# EAGLE design PT08Mpld (EAGLE 6.6.0)

## Sheet 1 of 3
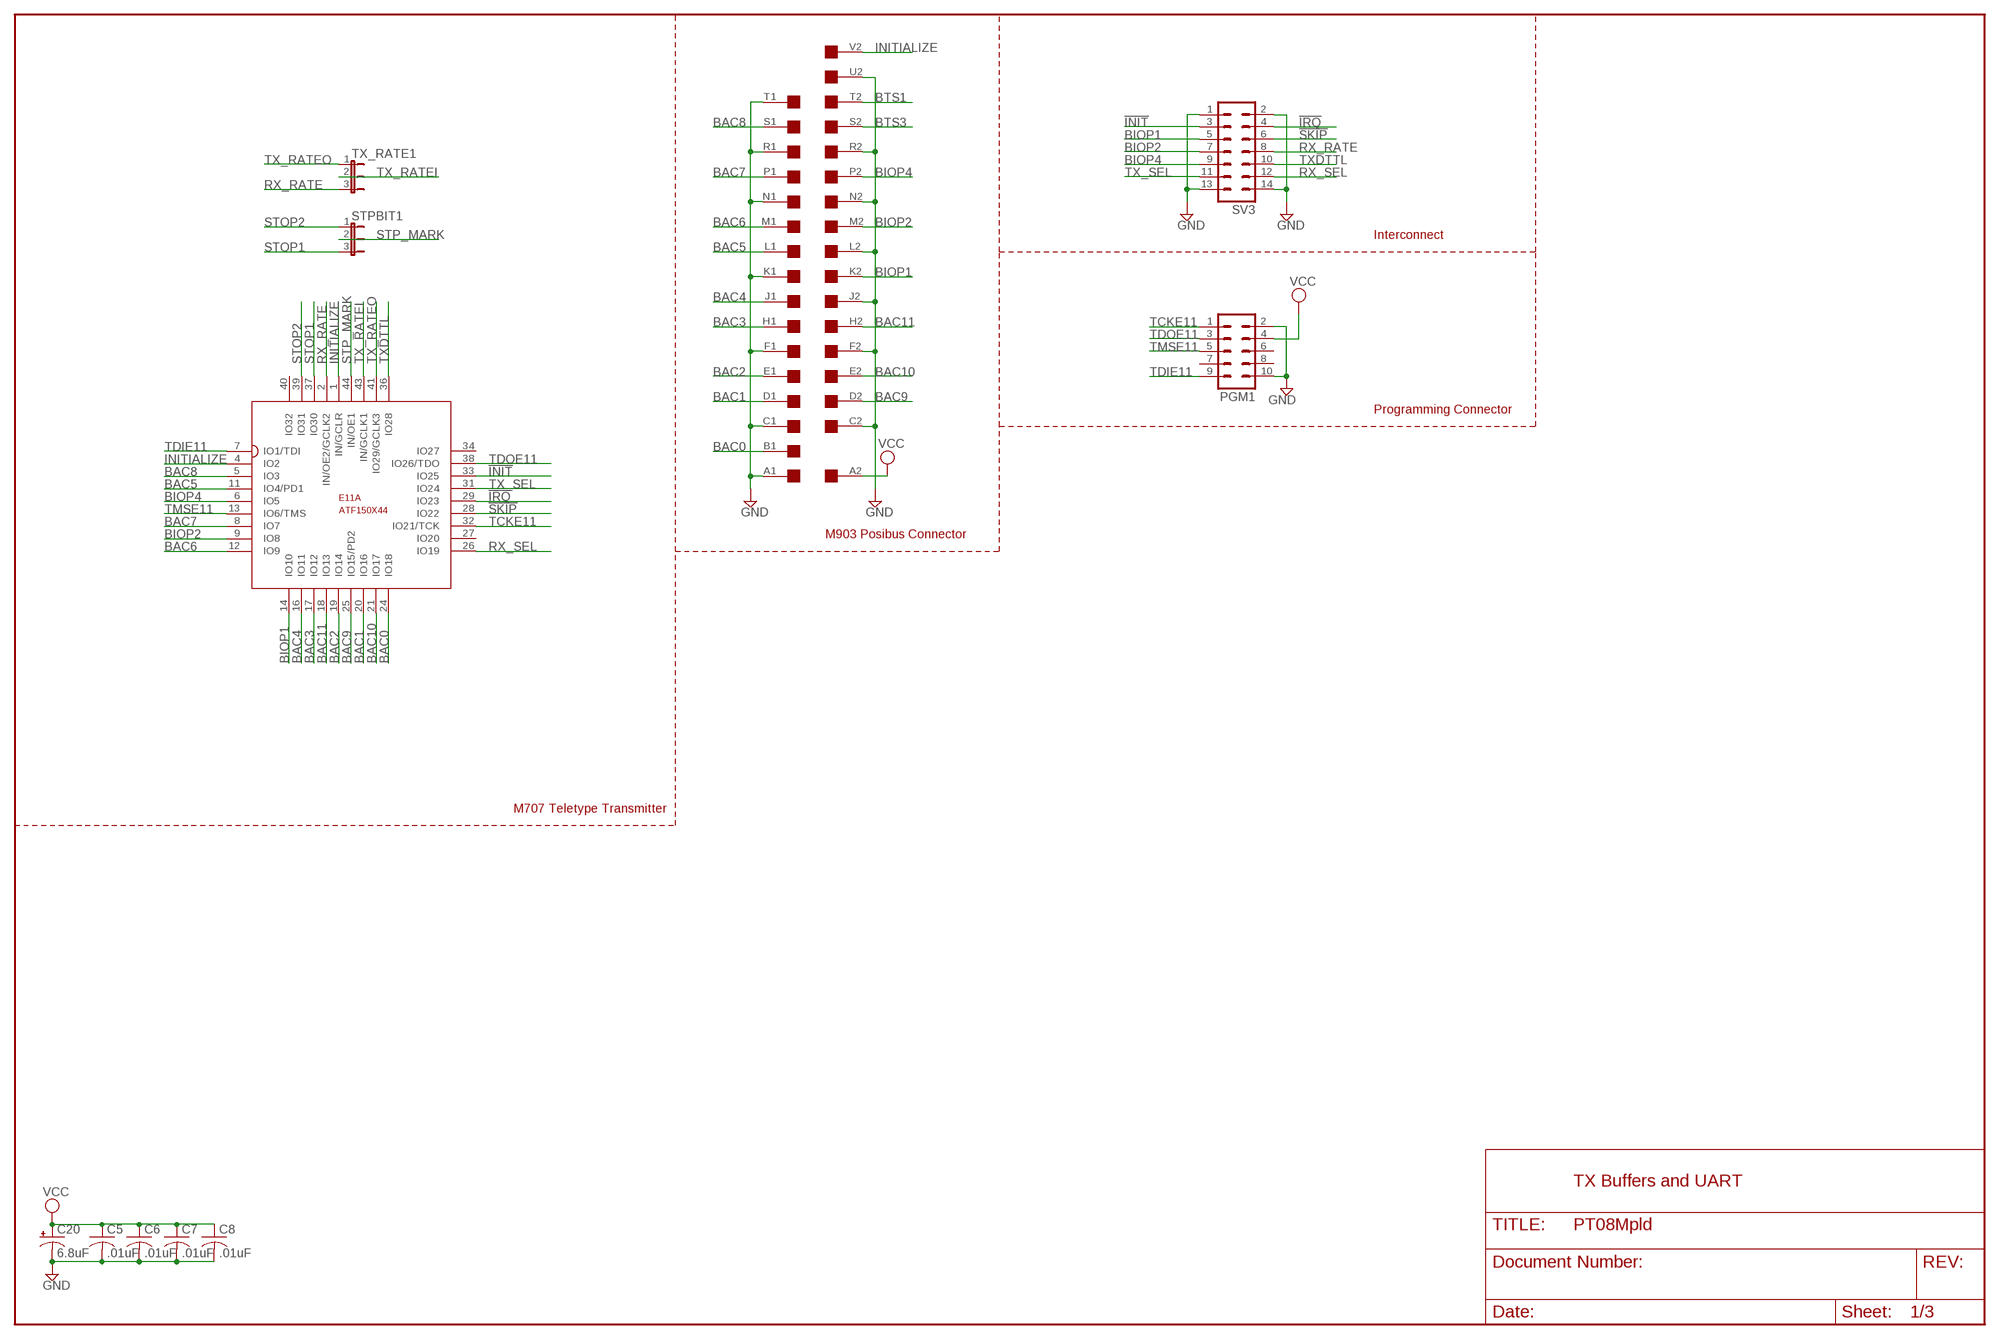
[diagram p0: schematic, sheet 1]

### Parts
BAC  EDGE-2CONNECTOR  [EDGE-CON2]
C5  .01uF  C-US050-025X075  [C050-025X075]
C6  .01uF  C-US050-025X075  [C050-025X075]
C7  .01uF  C-US050-025X075  [C050-025X075]
C8  .01uF  C-US050-025X075  [C050-025X075]
C20  6.8uF  CPOL-USE20-8AXIAL  [E12-8]
E11  ATF150X44  [3M44]
PGM1  ML10  [ML10]
STPBIT1  JP2E  [JP2]
SV3  ML14L  [ML14L]
TX_RATE1  JP2E  [JP2]

### Nets
!INIT: E11.33(A:IO25) SV3.3 ; also sheet 2,3
!IRQ: E11.29(A:IO23) SV3.4 ; also sheet 2,3
!SKIP: E11.28(A:IO22) SV3.6 ; also sheet 2,3
BAC0: BAC.B1 E11.24(A:IO18)
BAC1: BAC.D1 E11.20(A:IO16)
BAC2: BAC.E1 E11.19(A:IO14)
BAC3: BAC.H1 E11.17(A:IO12)
BAC4: BAC.J1 E11.16(A:IO11)
BAC5: BAC.L1 E11.11(A:IO4/PD1)
BAC6: BAC.M1 E11.12(A:IO9)
BAC7: BAC.P1 E11.8(A:IO7)
BAC8: BAC.S1 E11.5(A:IO3)
BAC9: BAC.D2 E11.25(A:IO15/PD2)
BAC10: BAC.E2 E11.21(A:IO17)
BAC11: BAC.H2 E11.18(A:IO13)
BIOP1: BAC.K2 E11.14(A:IO10) SV3.5 ; also sheet 2,3
BIOP2: BAC.M2 E11.9(A:IO8) SV3.7 ; also sheet 2,3
BIOP4: BAC.P2 E11.6(A:IO5) SV3.9 ; also sheet 2,3
BTS1: BAC.T2
BTS3: BAC.S2
GND [Supply]: BAC.A1 BAC.C1 BAC.C2 BAC.F1 BAC.F2 BAC.J2 BAC.K1 BAC.L2 BAC.N1 BAC.N2 BAC.R1 BAC.R2 BAC.T1 BAC.U2 C5.2 C6.2 C7.2 C8.2 C20.- PGM1.2 PGM1.10 SV3.1 SV3.2 SV3.13 SV3.14 ; also sheet 2,3
INITIALIZE: BAC.V2 E11.1(A:IN/GCLR) E11.4(A:IO2)
RX_RATE: E11.2(A:IN/OE2/GCLK2) SV3.8 TX_RATE1.3 ; also sheet 2,3
RX_SEL: E11.26(A:IO19) SV3.12 ; also sheet 2,3
STOP1: E11.37(A:IO30) STPBIT1.3
STOP2: E11.39(A:IO31) STPBIT1.1
STP_MARK: E11.44(A:IN/OE1) STPBIT1.2
TCKE11: E11.32(A:IO21/TCK) PGM1.1
TDIE11: E11.7(A:IO1/TDI) PGM1.9
TDOE11: E11.38(A:IO26/TDO) PGM1.3
TMSE11: E11.13(A:IO6/TMS) PGM1.5
TX_RATEI: E11.43(A:IN/GCLK1) TX_RATE1.2
TX_RATEO: E11.41(A:IO29/GCLK3) TX_RATE1.1
TX_SEL: E11.31(A:IO24) SV3.11 ; also sheet 2,3
TXDTTL: E11.36(A:IO28) SV3.10 ; also sheet 2,3
VCC [Supply]: BAC.A2 C5.1 C6.1 C7.1 C8.1 C20.+ PGM1.4 ; also sheet 2,3
Unconnected: BAC.B2 BAC.U1 BAC.V1 E11.27(A:IO20) E11.34(A:IO27) E11.40(A:IO32) PGM1.6 PGM1.7 PGM1.8

### Notes on the sheet
- Interconnect
- Programming Connector
- M903 Posibus Connector
- M707 Teletype Transmitter
- TX Buffers and UART

## Sheet 2 of 3
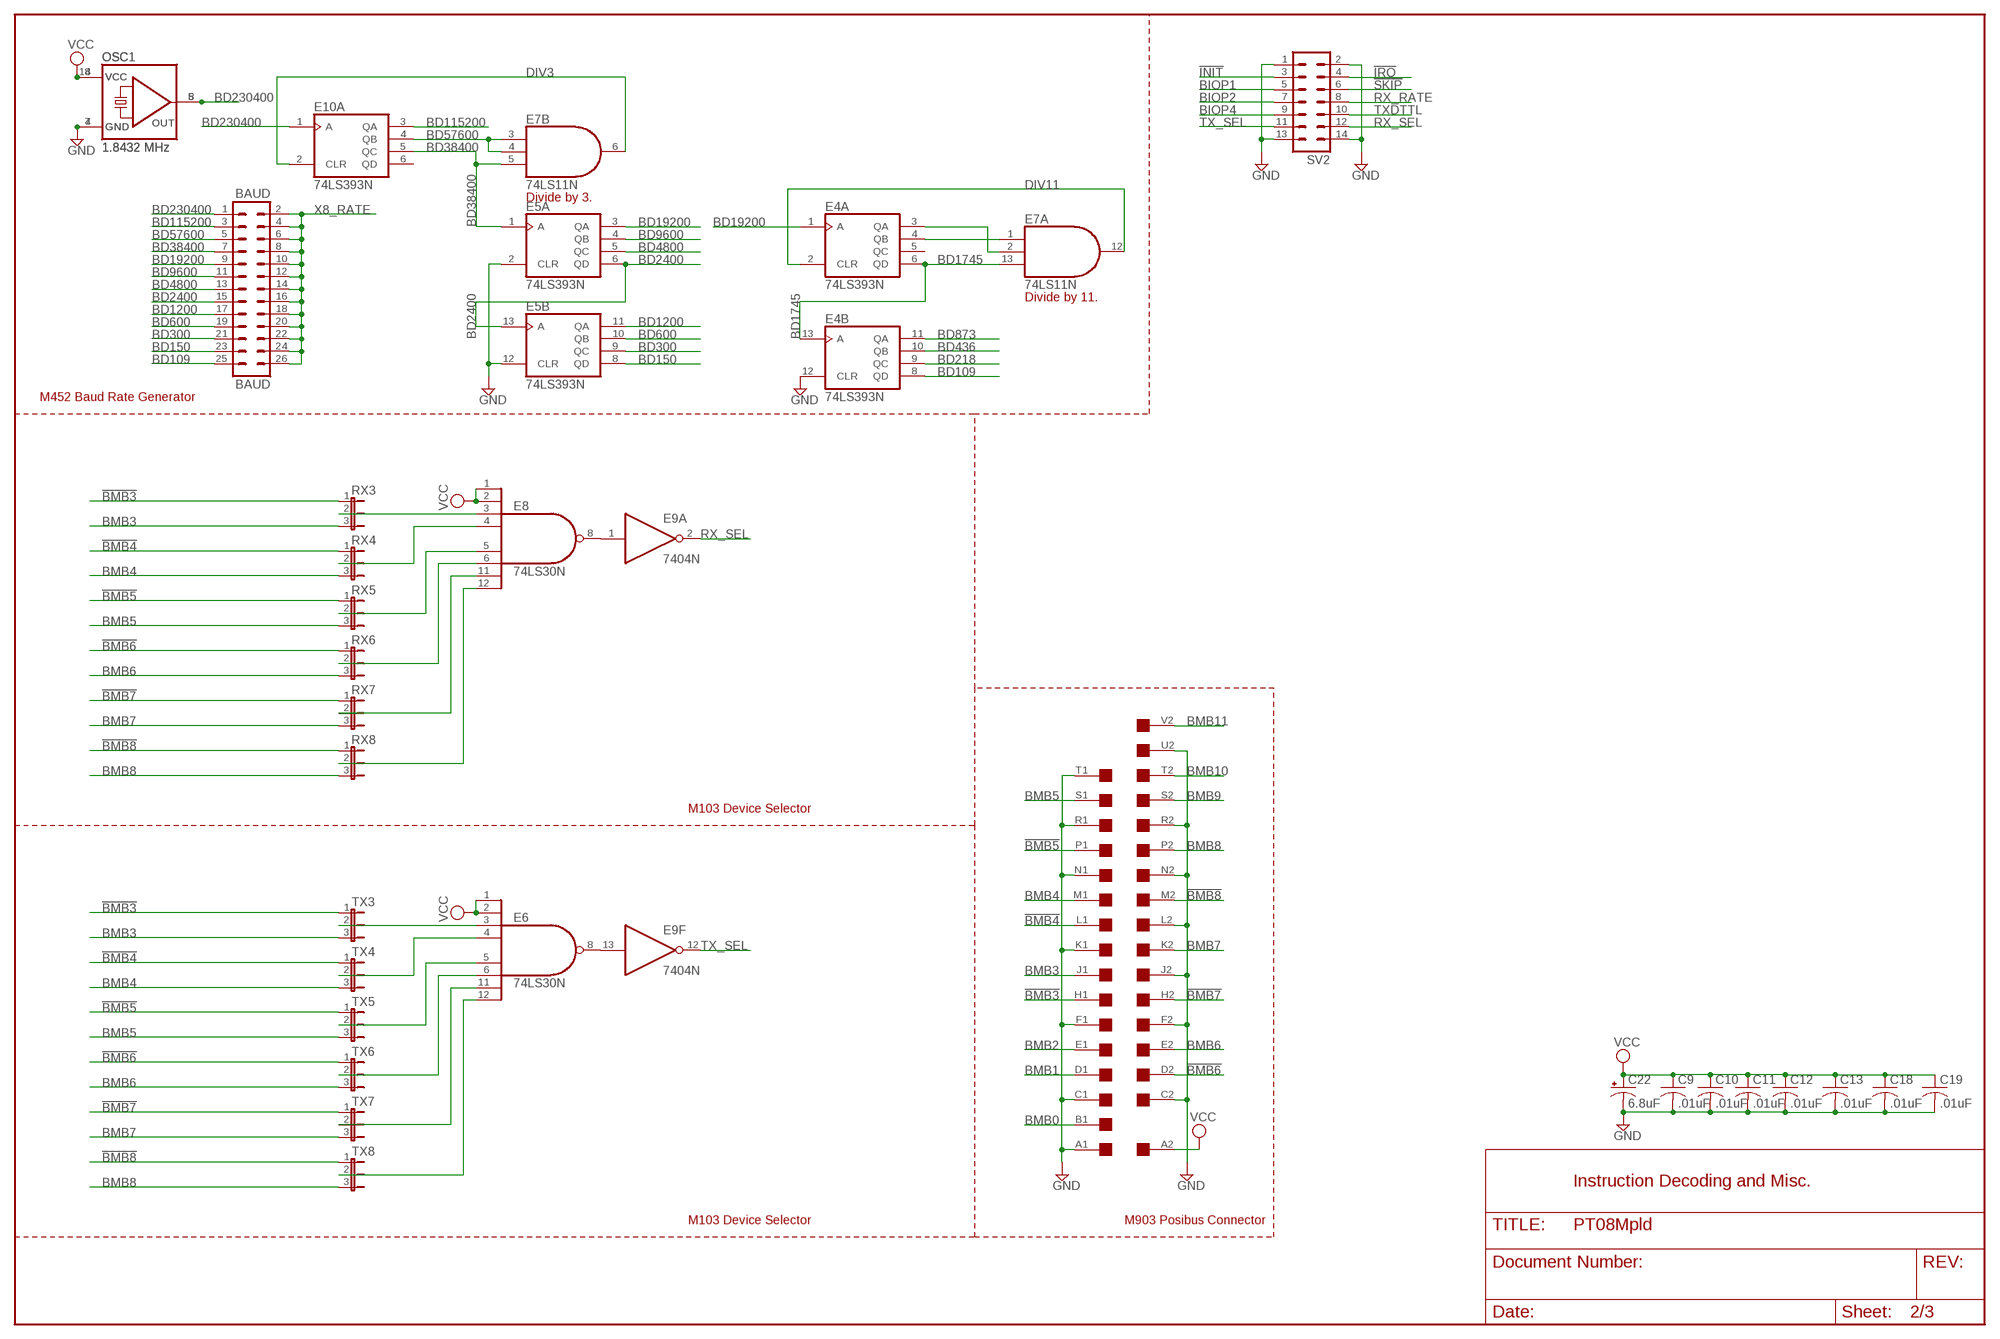
[diagram p1: schematic, sheet 2]

### Parts
BAUD  BAUD  MA13-2  [MA13-2]
BMB  EDGE-2CONNECTOR  [EDGE-CON2]
C9  .01uF  C-US050-025X075  [C050-025X075]
C10  .01uF  C-US050-025X075  [C050-025X075]
C11  .01uF  C-US050-025X075  [C050-025X075]
C12  .01uF  C-US050-025X075  [C050-025X075]
C13  .01uF  C-US050-025X075  [C050-025X075]
C18  .01uF  C-US050-025X075  [C050-025X075]
C19  .01uF  C-US050-025X075  [C050-025X075]
C22  6.8uF  CPOL-USE20-8AXIAL  [E12-8]
E4  74LS393N  [DIL14]
E5  74LS393N  [DIL14]
E6  74LS30N  [DIL14]
E7  74LS11N  [DIL14]
E8  74LS30N  [DIL14]
E9  7404N  [DIL14]
E10  74LS393N  [DIL14]
OSC  1.8432 MHz  QG5460  [DIL08S]
OSC1  1.8432 MHz  QG5860  [DIL14S]
RX3  JP2E  [JP2]
RX4  JP2E  [JP2]
RX5  JP2E  [JP2]
RX6  JP2E  [JP2]
RX7  JP2E  [JP2]
RX8  JP2E  [JP2]
SV2  ML14L  [ML14L]
TX3  JP2E  [JP2]
TX4  JP2E  [JP2]
TX5  JP2E  [JP2]
TX6  JP2E  [JP2]
TX7  JP2E  [JP2]
TX8  JP2E  [JP2]

### Nets
!BMB3: BMB.H1 RX3.1 TX3.1
!BMB4: BMB.L1 RX4.1 TX4.1
!BMB5: BMB.P1 RX5.1 TX5.1
!BMB6: BMB.D2 RX6.1 TX6.1
!BMB7: BMB.H2 RX7.1 TX7.1
!BMB8: BMB.M2 RX8.1 TX8.1
!INIT: SV2.3 ; also sheet 1,3
!IRQ: SV2.4 ; also sheet 1,3
!RX_SEL: E8.8(O) E9.1(A:I)
!SKIP: SV2.6 ; also sheet 1,3
!TX_SEL: E6.8(O) E9.13(F:I)
BD109: BAUD.25 E4.8(B:QD)
BD150: BAUD.23 E5.8(B:QD)
BD218: E4.9(B:QC)
BD300: BAUD.21 E5.9(B:QC)
BD436: E4.10(B:QB)
BD600: BAUD.19 E5.10(B:QB)
BD873: E4.11(B:QA)
BD1200: BAUD.17 E5.11(B:QA)
BD1745: E4.6(A:QD) E4.13(B:A) E7.13(A:I2)
BD2400: BAUD.15 E5.6(A:QD) E5.13(B:A)
BD4800: BAUD.13 E5.5(A:QC)
BD9600: BAUD.11 E5.4(A:QB)
BD19200: BAUD.9 E4.1(A:A) E5.3(A:QA)
BD38400: BAUD.7 E5.1(A:A) E7.5(B:I2) E10.5(A:QC)
BD57600: BAUD.5 E7.3(B:I0) E7.4(B:I1) E10.4(A:QB)
BD115200: BAUD.3 E10.3(A:QA)
BD230400: BAUD.1 E10.1(A:A) OSC1.8(OUT) OSC.5(OUT)
BIOP1: SV2.5 ; also sheet 1,3
BIOP2: SV2.7 ; also sheet 1,3
BIOP4: SV2.9 ; also sheet 1,3
BMB0: BMB.B1
BMB1: BMB.D1
BMB2: BMB.E1
BMB3: BMB.J1 RX3.3 TX3.3
BMB4: BMB.M1 RX4.3 TX4.3
BMB5: BMB.S1 RX5.3 TX5.3
BMB6: BMB.E2 RX6.3 TX6.3
BMB7: BMB.K2 RX7.3 TX7.3
BMB8: BMB.P2 RX8.3 TX8.3
BMB9: BMB.S2
BMB10: BMB.T2
BMB11: BMB.V2
DIV3 [Supply]: E7.6(B:O) E10.2(A:CLR)
DIV11: E4.2(A:CLR) E7.12(A:O)
GND [Supply]: BMB.A1 BMB.C1 BMB.C2 BMB.F1 BMB.F2 BMB.J2 BMB.K1 BMB.L2 BMB.N1 BMB.N2 BMB.R1 BMB.R2 BMB.T1 BMB.U2 C9.2 C10.2 C11.2 C12.2 C13.2 C18.2 C19.2 C22.- E4.12(B:CLR) E5.2(A:CLR) E5.12(B:CLR) OSC1.7(GND) OSC.4(GND) SV2.1 SV2.2 SV2.13 SV2.14 ; also sheet 1,3
N$12: E4.3(A:QA) E7.2(A:I1)
N$25: E4.4(A:QB) E7.1(A:I0)
RX3: E8.3(I2) RX3.2
RX4: E8.4(I3) RX4.2
RX5: E8.5(I4) RX5.2
RX6: E8.6(I5) RX6.2
RX7: E8.11(I6) RX7.2
RX8: E8.12(I7) RX8.2
RX_RATE: SV2.8 ; also sheet 1,3
RX_SEL: E9.2(A:O) SV2.12 ; also sheet 1,3
TX3: E6.3(I2) TX3.2
TX4: E6.4(I3) TX4.2
TX5: E6.5(I4) TX5.2
TX6: E6.6(I5) TX6.2
TX7: E6.11(I6) TX7.2
TX8: E6.12(I7) TX8.2
TX_SEL: E9.12(F:O) SV2.11 ; also sheet 1,3
TXDTTL: SV2.10 ; also sheet 1,3
VCC [Supply]: BMB.A2 C9.1 C10.1 C11.1 C12.1 C13.1 C18.1 C19.1 C22.+ E6.1(I0) E6.2(I1) E8.1(I0) E8.2(I1) OSC1.14(VCC) OSC.8(VCC) ; also sheet 1,3
X8_RATE: BAUD.2 BAUD.4 BAUD.6 BAUD.8 BAUD.10 BAUD.12 BAUD.14 BAUD.16 BAUD.18 BAUD.20 BAUD.22 BAUD.24 BAUD.26
Unconnected: BMB.B2 BMB.U1 BMB.V1 E4.5(A:QC) E7.8(C:O) E7.9(C:I0) E7.10(C:I1) E7.11(C:I2) E9.3(B:I) E9.4(B:O) E9.5(C:I) E9.6(C:O) E9.8(D:O) E9.9(D:I) E9.10(E:O) E9.11(E:I) E10.6(A:QD) E10.8(B:QD) E10.9(B:QC) E10.10(B:QB) E10.11(B:QA) E10.12(B:CLR) E10.13(B:A)

### Notes on the sheet
- Divide by 3.
- Divide by 11.
- M452 Baud Rate Generator
- M103 Device Selector
- Instruction Decoding and Misc.
- M103 Device Selector | M903 Posibus Connector

## Sheet 3 of 3
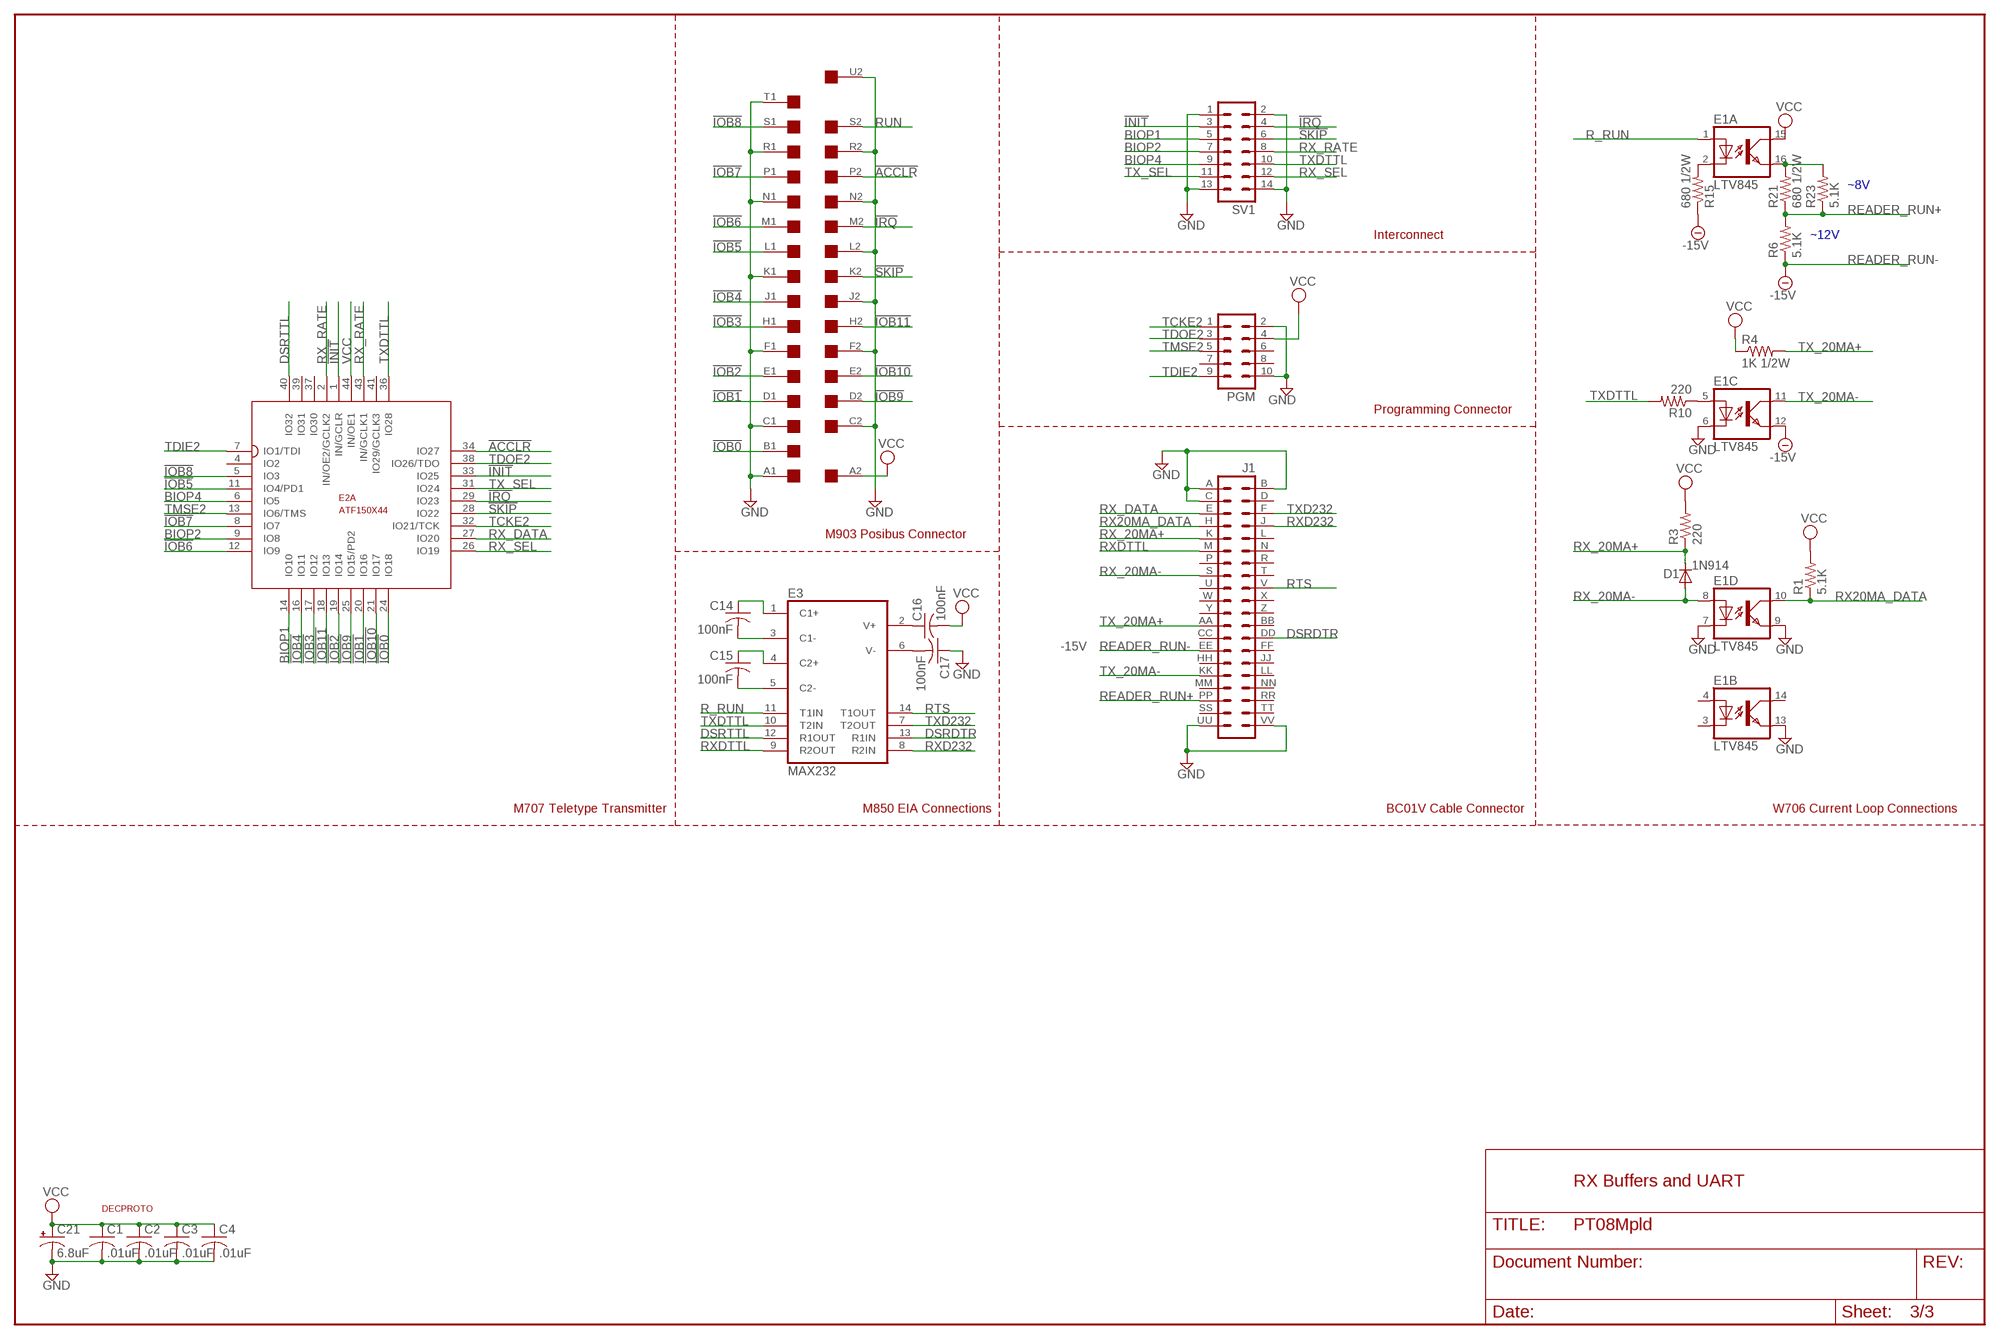
[diagram p2: schematic, sheet 3]

### Parts
C1  .01uF  C-US050-025X075  [C050-025X075]
C2  .01uF  C-US050-025X075  [C050-025X075]
C3  .01uF  C-US050-025X075  [C050-025X075]
C4  .01uF  C-US050-025X075  [C050-025X075]
C14  100nF  C-US050-025X075  [C050-025X075]
C15  100nF  C-US050-025X075  [C050-025X075]
C16  100nF  C-US050-025X075  [C050-025X075]
C17  100nF  C-US050-025X075  [C050-025X075]
C21  6.8uF  CPOL-USE20-8AXIAL  [E12-8]
D1  1N914  1N4004  [DO41-10]
E1  LTV845  ILQ1  [DIL16]
E2  ATF150X44  [3M44]
E3  MAX232  [DIL16]
IOB  EDGE-2CONNECTOR  [EDGE-CON2]
J1  DEC40PINH  [DEC40PINH]
PGM  ML10  [ML10]
R1  5.1K  R-US_0207/10  [0207/10]
R3  220  R-US_0207/10  [0207/10]
R4  1K 1/2W  R-US_0207/12  [0207/12]
R6  5.1K  R-US_0207/10  [0207/10]
R10  220  R-US_0207/10  [0207/10]
R15  680 1/2W  R-US_0207/12  [0207/12]
R21  680 1/2W  R-US_0207/12  [0207/12]
R23  5.1K  R-US_0207/10  [0207/10]
SV1  ML14L  [ML14L]
U$2  DECPROTO  [DECPROTO111]

### Nets
!ACCLR: E2.34(A:IO27) IOB.P2
!INIT: E2.1(A:IN/GCLR) E2.33(A:IO25) SV1.3 ; also sheet 1,2
!IOB0: E2.24(A:IO18) IOB.B1
!IOB1: E2.20(A:IO16) IOB.D1
!IOB2: E2.19(A:IO14) IOB.E1
!IOB3: E2.17(A:IO12) IOB.H1
!IOB4: E2.16(A:IO11) IOB.J1
!IOB5: E2.11(A:IO4/PD1) IOB.L1
!IOB6: E2.12(A:IO9) IOB.M1
!IOB7: E2.8(A:IO7) IOB.P1
!IOB8: E2.5(A:IO3) IOB.S1
!IOB9: E2.25(A:IO15/PD2) IOB.D2
!IOB10: E2.21(A:IO17) IOB.E2
!IOB11: E2.18(A:IO13) IOB.H2
!IRQ: E2.29(A:IO23) IOB.M2 SV1.4 ; also sheet 1,2
!SKIP: E2.28(A:IO22) IOB.K2 SV1.6 ; also sheet 1,2
-15V [Supply]: E1.12(C:EMIT) J1.EE R6.1 R15.1
BIOP1: E2.14(A:IO10) SV1.5 ; also sheet 1,2
BIOP2: E2.9(A:IO8) SV1.7 ; also sheet 1,2
BIOP4: E2.6(A:IO5) SV1.9 ; also sheet 1,2
DSRDTR: E3.13(R1IN) J1.DD
DSRTTL: E2.40(A:IO32) E3.12(R1OUT)
GND [Supply]: C1.2 C2.2 C3.2 C4.2 C17.1 C21.- E1.6(C:C) E1.7(D:C) E1.9(D:EMIT) E1.13(B:EMIT) IOB.A1 IOB.C1 IOB.C2 IOB.F1 IOB.F2 IOB.J2 IOB.K1 IOB.L2 IOB.N1 IOB.N2 IOB.R1 IOB.R2 IOB.T1 IOB.U2 J1.A J1.B J1.C J1.UU J1.VV PGM.2 PGM.10 SV1.1 SV1.2 SV1.13 SV1.14 ; also sheet 1,2
N$5: E1.2(A:C) R15.2
N$7: E1.16(A:EMIT) R21.2 R23.2
N$15: E1.5(C:A) R10.1
N$16: C17.2 E3.6(V-)
N$17: C14.1 E3.1(C1+)
N$827: C14.2 E3.3(C1-)
N$914: C15.2 E3.5(C2-)
N$915: C15.1 E3.4(C2+)
N$916: C16.1 E3.2(V+)
R_RUN: E1.1(A:A) E3.11(T1IN)
READER_RUN+ [Supply]: J1.PP R6.2 R21.1 R23.1
RTS: E3.14(T1OUT) J1.V
RUN: IOB.S2
RX20MA_DATA: E1.10(D:COL) J1.H R1.1
RX_20MA+ [Supply]: D1.C J1.K R3.1
RX_20MA- [Supply]: D1.A E1.8(D:A) J1.S
RX_DATA: E2.27(A:IO20) J1.E
RX_RATE: E2.2(A:IN/OE2/GCLK2) E2.43(A:IN/GCLK1) SV1.8 ; also sheet 1,2
RX_SEL: E2.26(A:IO19) SV1.12 ; also sheet 1,2
RXD232: E3.8(R2IN) J1.J
RXDTTL: E3.9(R2OUT) J1.M
TCKE2: E2.32(A:IO21/TCK) PGM.1
TDIE2: E2.7(A:IO1/TDI) PGM.9
TDOE2: E2.38(A:IO26/TDO) PGM.3
TMSE2: E2.13(A:IO6/TMS) PGM.5
TX_20MA+ [Supply]: J1.AA R4.2
TX_20MA- [Supply]: E1.11(C:COL) J1.KK
TX_SEL: E2.31(A:IO24) SV1.11 ; also sheet 1,2
TXD232: E3.7(T2OUT) J1.F
TXDTTL: E2.36(A:IO28) E3.10(T2IN) R10.2 SV1.10 ; also sheet 1,2
VCC [Supply]: C1.1 C2.1 C3.1 C4.1 C16.2 C21.+ E1.15(A:COL) E2.44(A:IN/OE1) IOB.A2 PGM.4 R1.2 R3.2 R4.1 ; also sheet 1,2
Unconnected: E1.3(B:C) E1.4(B:A) E1.14(B:COL) E2.4(A:IO2) E2.37(A:IO30) E2.39(A:IO31) E2.41(A:IO29/GCLK3) IOB.B2 IOB.T2 IOB.U1 IOB.V1 IOB.V2 J1.BB J1.CC J1.D J1.FF J1.HH J1.JJ J1.L J1.LL J1.MM J1.N J1.NN J1.P J1.R J1.RR J1.SS J1.T J1.TT J1.U J1.W J1.X J1.Y J1.Z PGM.6 PGM.7 PGM.8

### Notes on the sheet
- ~8V
- Interconnect | ~12V
- READER_RUN-
- Programming Connector
- M903 Posibus Connector
- READER_RUN-
- M707 Teletype Transmitter | M850 EIA Connections | BC01V Cable Connector | W706 Current Loop Connections
- RX Buffers and UART

## Power pins joined to a net without a drawn wire
GND: E2.10(GND) E2.22(GND) E2.30(GND) E2.42(GND) E3.15(GND) E4.7(P:GND) E5.7(P:GND) E6.7(GND) E7.7(P:GND) E8.7(GND) E9.7(P:GND) E10.7(P:GND) E11.10(GND) E11.22(GND) E11.30(GND) E11.42(GND)
VCC: E2.3(VCC) E2.15(VCC) E2.23(VCC) E2.35(VCC) E3.16(VCC) E4.14(P:VCC) E5.14(P:VCC) E6.14(VCC) E7.14(P:VCC) E8.14(VCC) E9.14(P:VCC) E10.14(P:VCC) E11.3(VCC) E11.15(VCC) E11.23(VCC) E11.35(VCC)

## Library data of the parts
BAC BMB IOB = dec-con:EDGE-2: Double-Sided DEC edge connector.
BAUD = con-lstb:MA13-2: PIN HEADER; OC_FARNELL: unknown; OC_NEWARK: unknown
C1-C19 = rcl:C-US: CAPACITOR, American symbol
C20-C22 = dec-con:CPOL-USE20-8AXIAL: A 0.8 inch electrolytic.
D1 = diode:1N4004: DIODE general purpose rectifier, 1 A
E1 = optocoupler:ILQ1: SIEMENS OPTO COUPLER; MF: VISHAY/TELEFUNKEN; MPN: ILQ1; OC_FARNELL: 1469501; OC_NEWARK: 88K1954
E2 E11 = atmel-cpld:ATF150X44: ATF150x in 44 pin packages
E3 = maxim:MAX232: RS232 TRANSCEIVER; MF: MAXIM; MPN: MAX232ACPE+; OC_FARNELL: 9723773; OC_NEWARK: 68K4544
E4 E5 E10 = 74xx-us:74*393: Dual 4-bit decade and binary COUNTER
E6 E8 = 74xx-us:74*30: 8-input NAND gate
E7 = 74xx-us:74*11: Triple 3-input AND gate
E9 = 74xx-us:74*04: Hex INVERTER
J1 = dec-con:DEC40PIN: PIN HEADER
OSC = crystal:QG5460: CRYSTAL RESONATOR; OC_FARNELL: unknown; OC_NEWARK: unknown
OSC1 = crystal:QG5860: CRYSTAL RESONATOR; OC_FARNELL: unknown; OC_NEWARK: unknown
PGM PGM1 = con-harting-ml:ML10: HARTING; OC_FARNELL: unknown; OC_NEWARK: unknown
R1 R3 R4 R6 R10 R15 R21 R23 = rcl:R-US_: RESISTOR, American symbol
RX3-RX8 STPBIT1 TX3-TX8 TX_RATE1 = jumper:JP2E: JUMPER
SV1-SV3 = con-harting-ml:ML14: HARTING; OC_FARNELL: unknown; OC_NEWARK: unknown
U$2 = dec-con:DECPROTO: Various small DEC boards stuck together with break-away tab routing.

## Net classes
1 Supply: width 0.711 mm

## Board
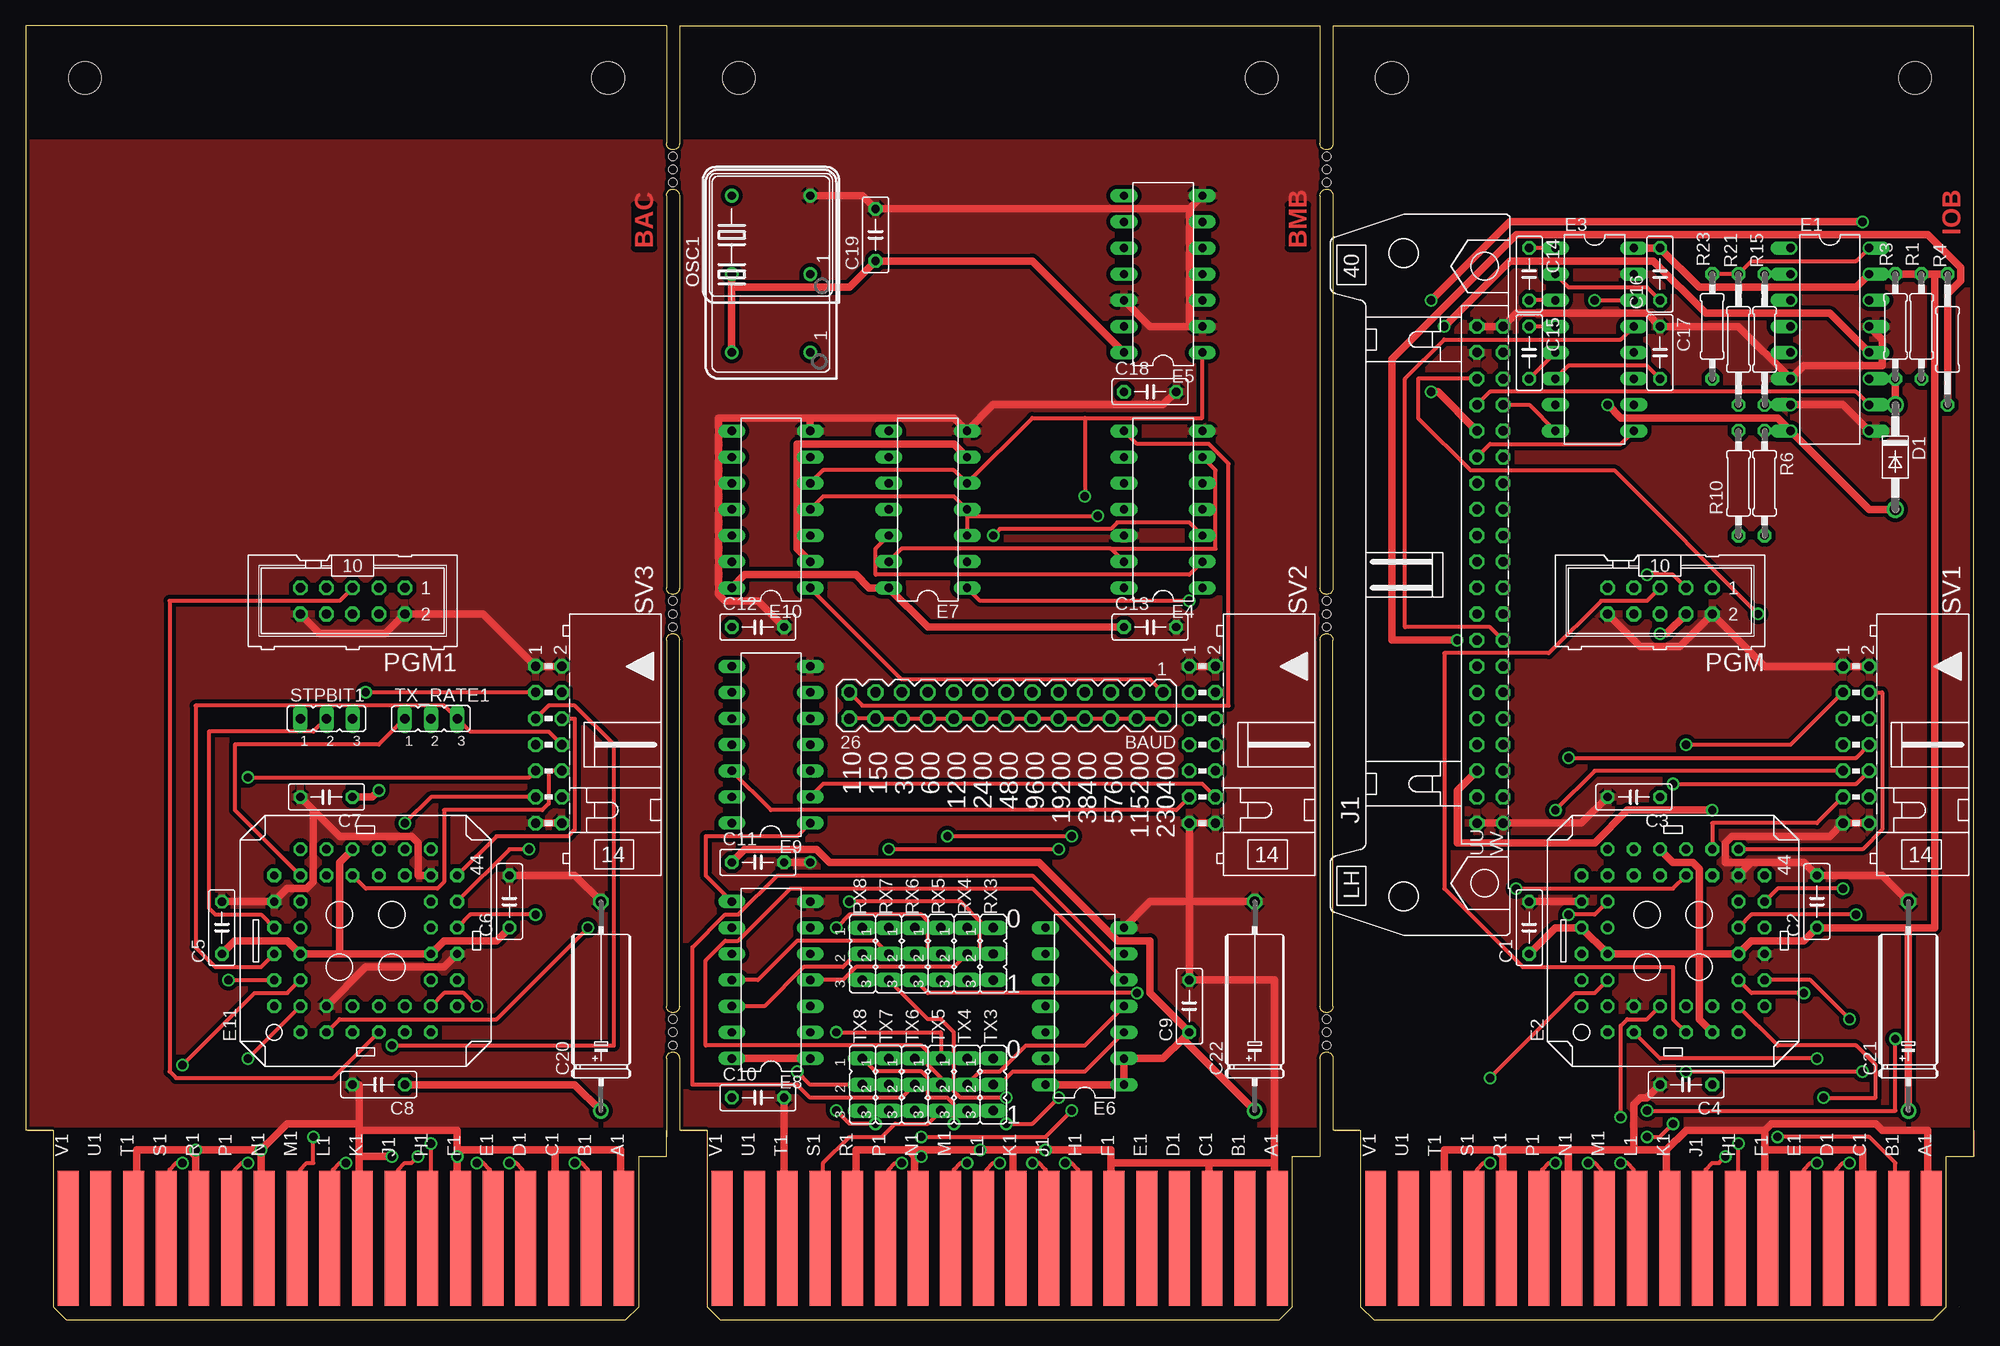
[diagram p3: board, top side]
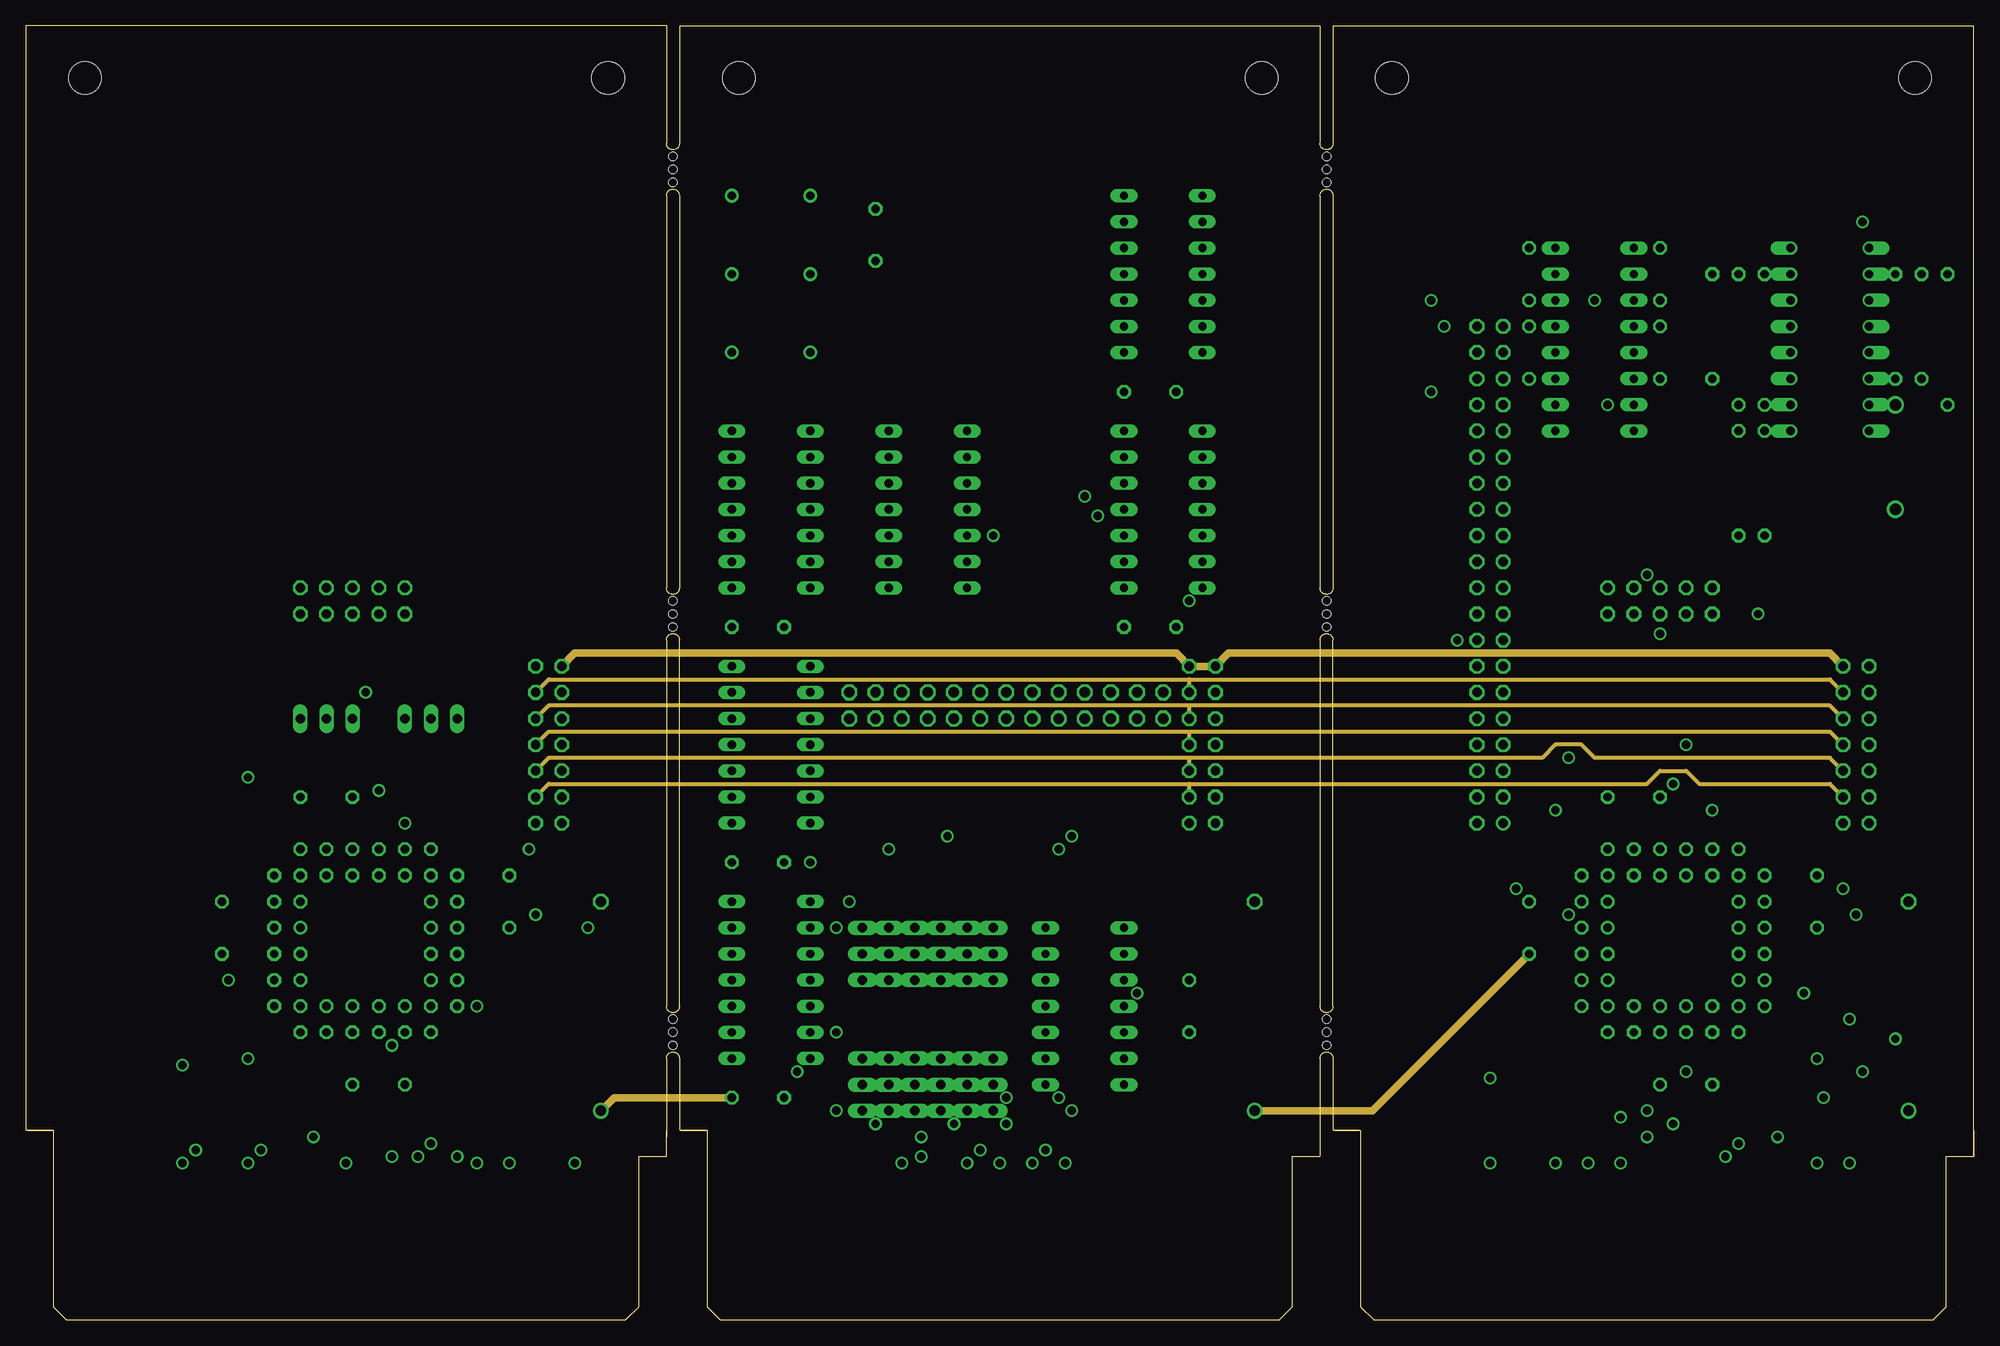
[diagram p4: board, inner layer ECO1]
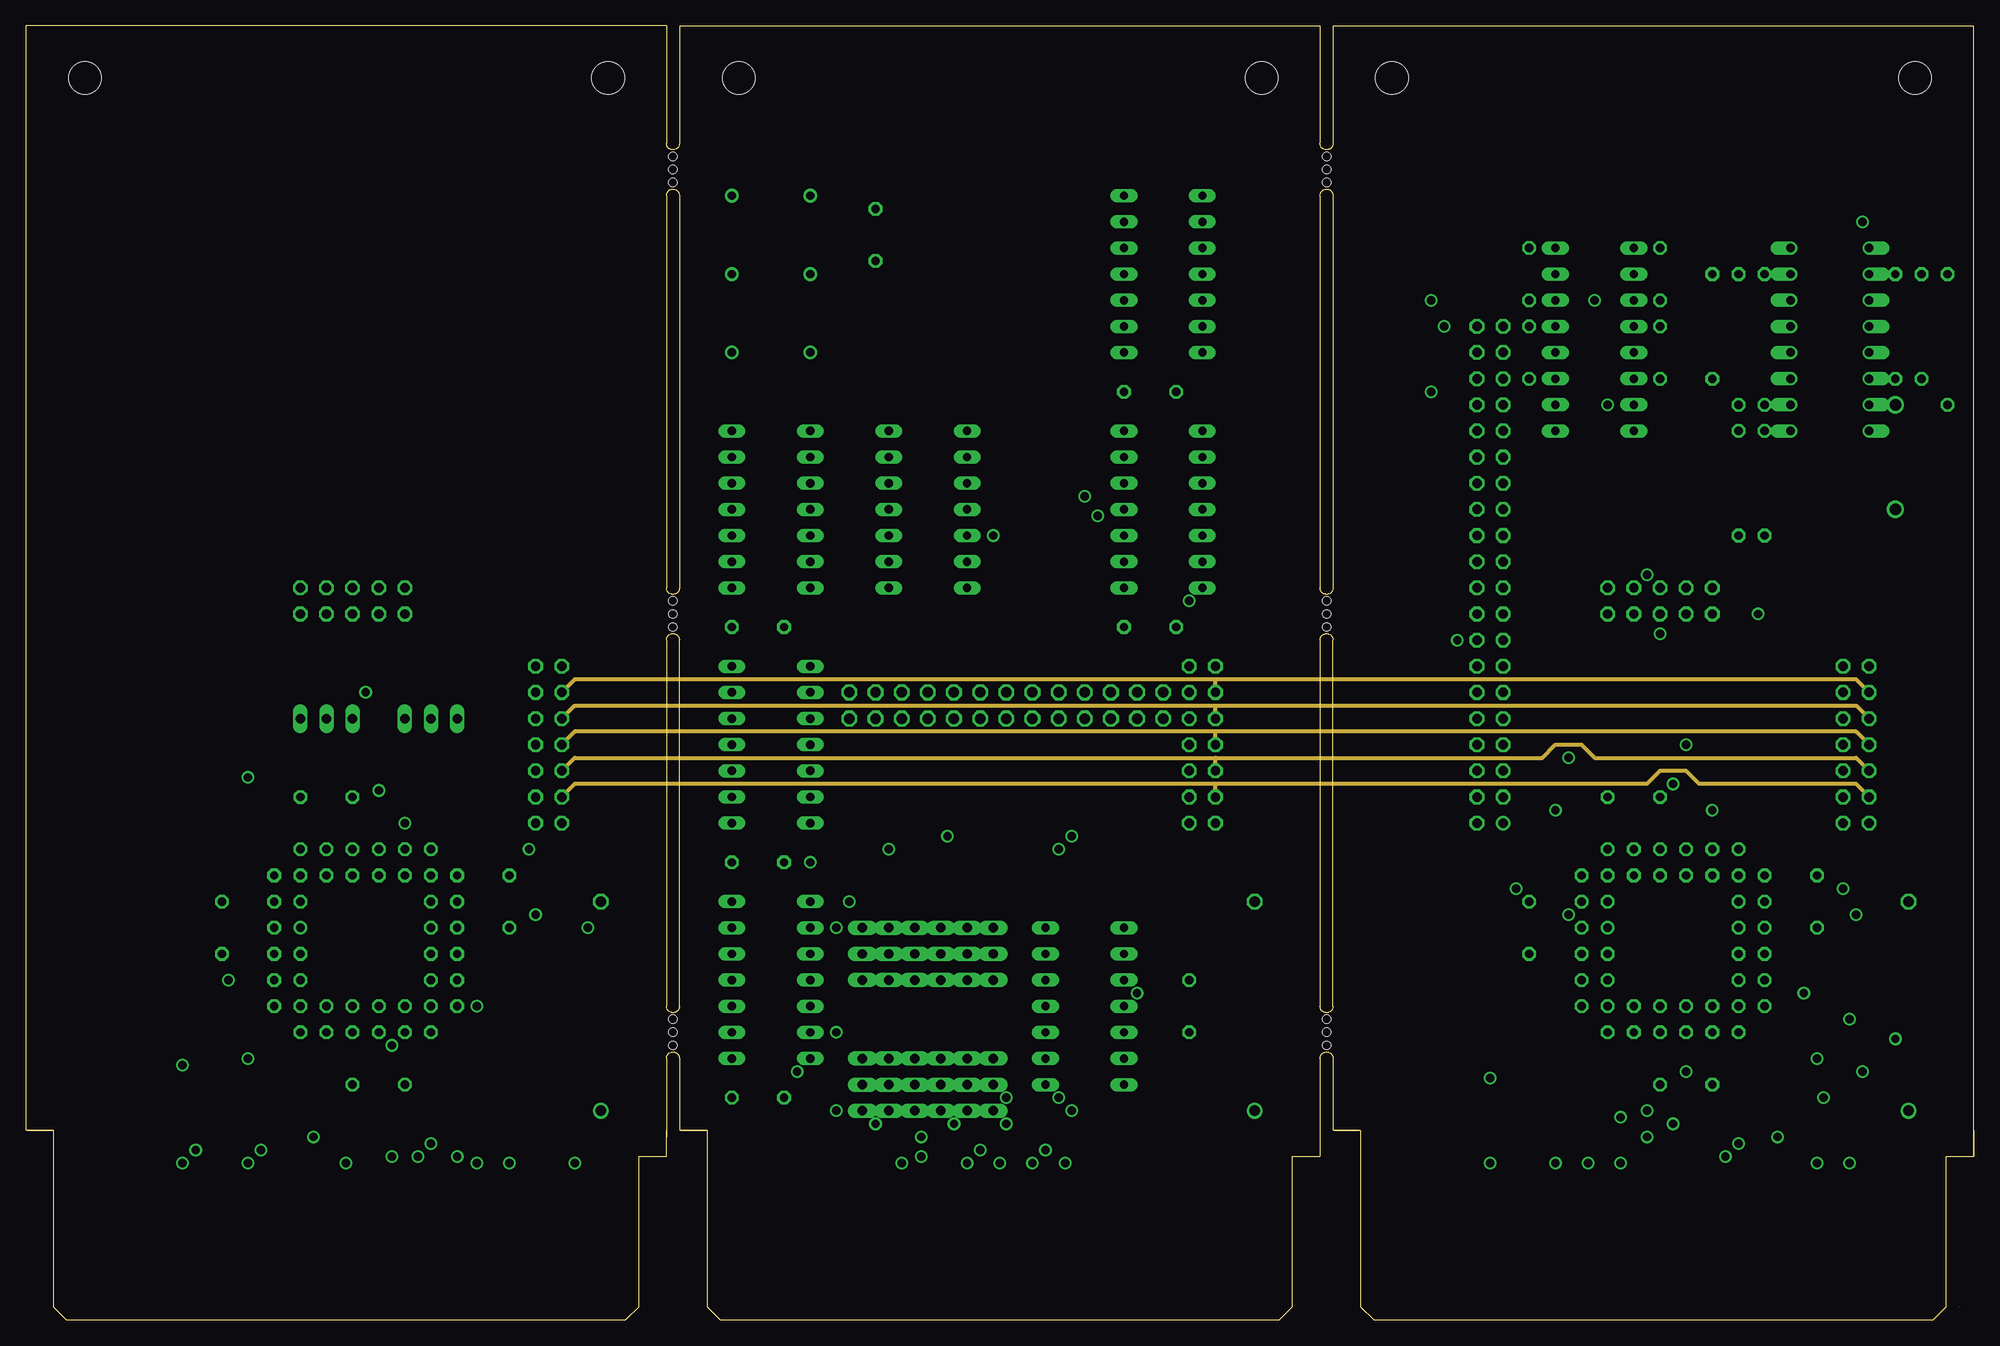
[diagram p5: board, inner layer ECO2]
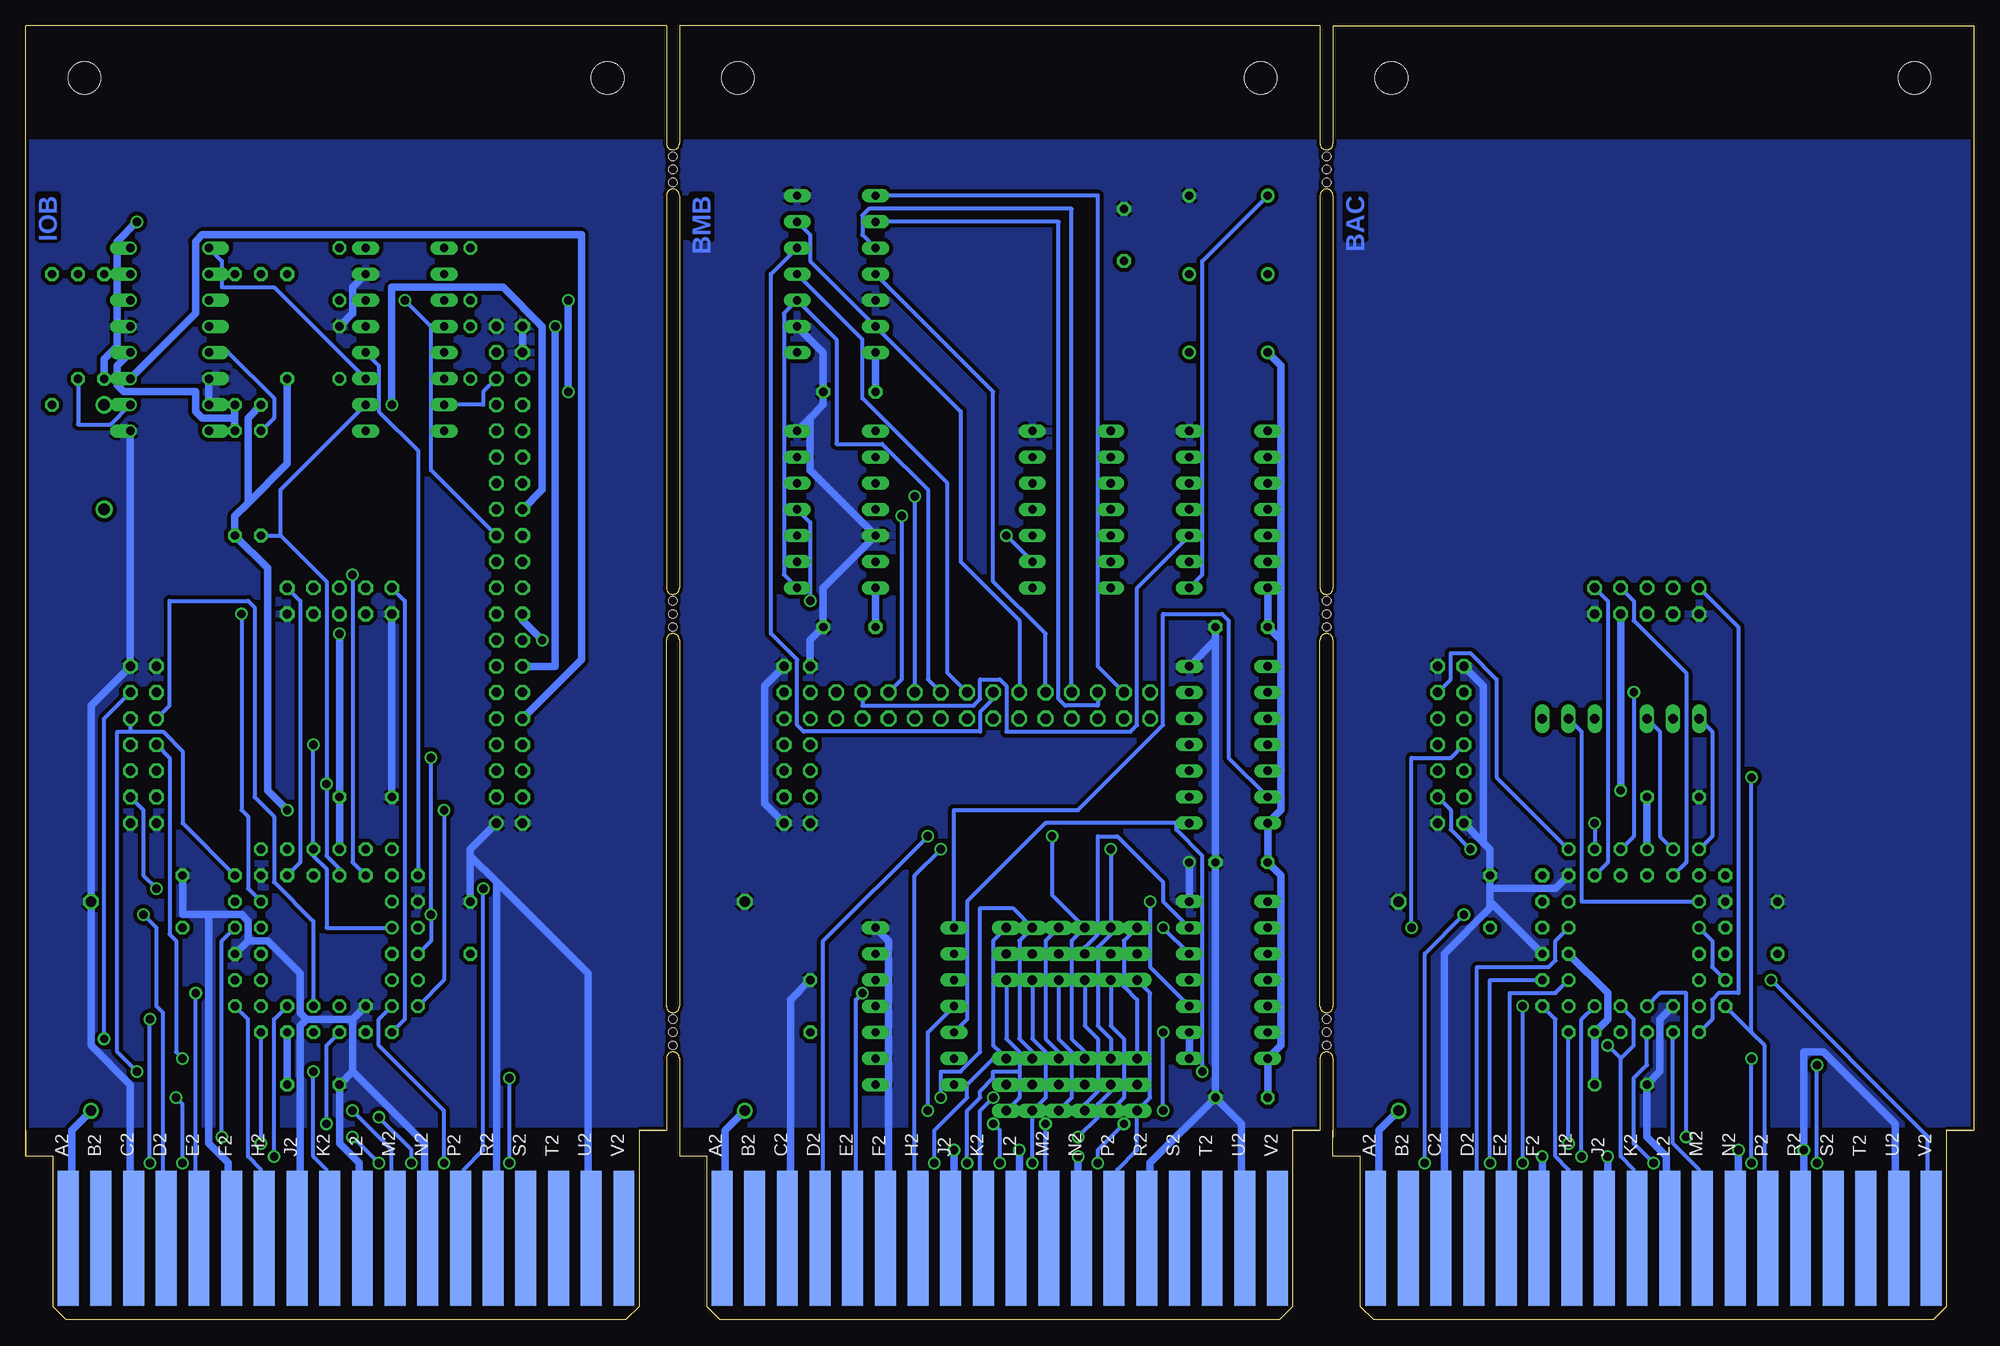
[diagram p6: board, bottom side, seen from below]

Size 189.23 x 125.73 mm. Coordinates in mm from the lower left corner, seen from the top.
Copper layers (1+2+15+16): Top 0.035mm / dielectric 1.5mm / ECO1 0.035mm / dielectric 0.15mm / ECO2 0.035mm / dielectric 0.2mm / Bottom 0.035mm
Design rules "16mils *": minimum track width 16mil, minimum drill 32mil, track to track 15mil, track to pad 10mil, pad to pad 10mil, via to via 10mil, smd to smd 10mil, copper to edge 13mil, drill to drill 10mil, minimum pad ring 10mil, minimum via ring 8mil, stop-mask expansion 0mil, vias tented up to drill 0mil, thermal gap 10mil

### Footprints (pad centres in the part's own frame; a part is rotated, then mirrored left to right if it is on the bottom)
EDGE-CON2 = smd 13.106 x 2.032: A1 7.938,4.128; B1 7.938,7.303; C1 7.938,10.477; D1 7.938,13.652; E1 7.938,16.828; F1 7.938,20.003; H1 7.938,23.177; J1 7.938,26.352; K1 7.938,29.527; L1 7.938,32.703; M1 7.938,35.877; N1 7.938,39.053; P1 7.938,42.227; R1 7.938,45.403; S1 7.938,48.578; T1 7.938,51.752; U1 7.938,54.928; V1 7.938,58.102 | smd 13.106 x 2.032 bottom: A2 7.938,4.128; B2 7.938,7.303; C2 7.938,10.477; D2 7.938,13.652; E2 7.938,16.828; F2 7.938,20.003; H2 7.938,23.177; J2 7.938,26.352; K2 7.938,29.527; L2 7.938,32.703; M2 7.938,35.877; N2 7.938,39.053; P2 7.938,42.227; R2 7.938,45.403; S2 7.938,48.578; T2 7.938,51.752; U2 7.938,54.928; V2 7.938,58.102
MA13-2 = drill 1.016 octagon: 1 -15.24,-1.27; 2 -15.24,1.27; 3 -12.7,-1.27; 4 -12.7,1.27; 5 -10.16,-1.27; 6 -10.16,1.27; 7 -7.62,-1.27; 8 -7.62,1.27; 9 -5.08,-1.27; 10 -5.08,1.27; 11 -2.54,-1.27; 12 -2.54,1.27; 13 0,-1.27; 14 0,1.27; 15 2.54,-1.27; 16 2.54,1.27; 17 5.08,-1.27; 18 5.08,1.27; 19 7.62,-1.27; 20 7.62,1.27; 21 10.16,-1.27; 22 10.16,1.27; 23 12.7,-1.27; 24 12.7,1.27; 25 15.24,-1.27; 26 15.24,1.27
C050-025X075 = drill 0.813 octagon: 1 -2.54,0; 2 2.54,0
E12-8 = drill 1.016: + -10.16,0 | drill 1.016 octagon: - 10.16,0
DO41-10 = drill 1.118: A 5.08,0; C -5.08,0
DIL16 = drill 0.813 offset: 1 -8.89,-3.81; 2 -6.35,-3.81; 3 -3.81,-3.81; 4 -1.27,-3.81; 5 1.27,-3.81; 6 3.81,-3.81; 7 6.35,-3.81; 8 8.89,-3.81; 9 8.89,3.81; 10 6.35,3.81; 11 3.81,3.81; 12 1.27,3.81; 13 -1.27,3.81; 14 -3.81,3.81; 15 -6.35,3.81; 16 -8.89,3.81
3M44 = drill 0.813: 1 1.27,6.35 | drill 0.813 octagon: 2 -1.27,8.89; 3 -1.27,6.35; 4 -3.81,8.89; 5 -3.81,6.35; 6 -6.35,8.89; 7 -8.89,6.35; 8 -6.35,6.35; 9 -8.89,3.81; 10 -6.35,3.81; 11 -8.89,1.27; 12 -6.35,1.27; 13 -8.89,-1.27; 14 -6.35,-1.27; 15 -8.89,-3.81; 16 -6.35,-3.81; 17 -8.89,-6.35; 18 -6.35,-8.89; 19 -6.35,-6.35; 20 -3.81,-8.89; 21 -3.81,-6.35; 22 -1.27,-8.89; 23 -1.27,-6.35; 24 1.27,-8.89; 25 1.27,-6.35; 26 3.81,-8.89; 27 3.81,-6.35; 28 6.35,-8.89; 29 8.89,-6.35; 30 6.35,-6.35; 31 8.89,-3.81; 32 6.35,-3.81; 33 8.89,-1.27; 34 6.35,-1.27; 35 8.89,1.27; 36 6.35,1.27; 37 8.89,3.81; 38 6.35,3.81; 39 8.89,6.35; 40 6.35,8.89; 41 6.35,6.35; 42 3.81,8.89; 43 3.81,6.35; 44 1.27,8.89
DIL16' = drill 0.813 long: 1 -8.89,-3.81; 2 -6.35,-3.81; 3 -3.81,-3.81; 4 -1.27,-3.81; 5 1.27,-3.81; 6 3.81,-3.81; 7 6.35,-3.81; 8 8.89,-3.81; 9 8.89,3.81; 10 6.35,3.81; 11 3.81,3.81; 12 1.27,3.81; 13 -1.27,3.81; 14 -3.81,3.81; 15 -6.35,3.81; 16 -8.89,3.81
DIL14 = drill 0.813 long: 1 -7.62,-3.81; 2 -5.08,-3.81; 3 -2.54,-3.81; 4 0,-3.81; 5 2.54,-3.81; 6 5.08,-3.81; 7 7.62,-3.81; 8 7.62,3.81; 9 5.08,3.81; 10 2.54,3.81; 11 0,3.81; 12 -2.54,3.81; 13 -5.08,3.81; 14 -7.62,3.81
DEC40PINH = drill 0.914 octagon: A 24.13,1.27; AA -3.81,1.27; B 24.13,-1.27; BB -3.81,-1.27; C 21.59,1.27; CC -6.35,1.27; D 21.59,-1.27; DD -6.35,-1.27; E 19.05,1.27; EE -8.89,1.27; F 19.05,-1.27; FF -8.89,-1.27; H 16.51,1.27; HH -11.43,1.27; J 16.51,-1.27; JJ -11.43,-1.27; K 13.97,1.27; KK -13.97,1.27; L 13.97,-1.27; LL -13.97,-1.27; M 11.43,1.27; MM -16.51,1.27; N 11.43,-1.27; NN -16.51,-1.27; P 8.89,1.27; PP -19.05,1.27; R 8.89,-1.27; RR -19.05,-1.27; S 6.35,1.27; SS -21.59,1.27; T 6.35,-1.27; TT -21.59,-1.27; U 3.81,1.27; UU -24.13,1.27; V 3.81,-1.27; W 1.27,1.27; X 1.27,-1.27; Y -1.27,1.27; Z -1.27,-1.27 | drill 0.914: VV -24.13,-1.27
DIL08S = drill 0.813: 1 -3.81,-3.81; 4 3.81,-3.81; 5 3.81,3.81; 8 -3.81,3.81
DIL14S = drill 0.813: 1 -7.62,-3.81; 7 7.62,-3.81; 8 7.62,3.81; 14 -7.62,3.81
ML10 = drill 0.914 octagon: 1 -5.08,-1.27; 2 -5.08,1.27; 3 -2.54,-1.27; 4 -2.54,1.27; 5 0,-1.27; 6 0,1.27; 7 2.54,-1.27; 8 2.54,1.27; 9 5.08,-1.27; 10 5.08,1.27
0207/10 = drill 0.813 octagon: 1 -5.08,0; 2 5.08,0
0207/12 = drill 0.813 octagon: 1 -6.35,0; 2 6.35,0
JP2 = drill 0.914 long: 1 -2.54,0; 2 0,0; 3 2.54,0
ML14L = drill 0.914 octagon: 1 -7.62,-1.27; 2 -7.62,1.27; 3 -5.08,-1.27; 4 -5.08,1.27; 5 -2.54,-1.27; 6 -2.54,1.27; 7 0,-1.27; 8 0,1.27; 9 2.54,-1.27; 10 2.54,1.27; 11 5.08,-1.27; 12 5.08,1.27; 13 7.62,-1.27; 14 7.62,1.27
DECPROTO111 = hole 3.175: 183.515,120.65; 132.715,120.65; 69.266,120.65; 120.066,120.65; 56.566,120.65; 5.766,120.65 | hole 0.813: 62.865,69.85; 62.865,68.58; 62.865,67.31; 62.865,26.67; 62.865,27.94; 62.865,29.21; 62.865,113.03; 62.865,110.49; 62.865,111.76; 126.365,69.85; 126.365,68.58; 126.365,67.31; 126.365,26.67; 126.365,27.94; 126.365,29.21; 126.365,113.03; 126.365,110.49; 126.365,111.76

### Placement (x,y rotation side)
BAC  62.23,0 90 top
BAUD  95.25,59.69 180 top
BMB  125.73,0 90 top
C1  146.05,38.1 90 top
C2  173.99,40.64 90 top
C3  156.21,50.8 180 top
C4  161.29,22.86 180 top
C5  19.05,38.1 90 top
C6  46.99,40.64 90 top
C7  29.21,50.8 180 top
C8  34.29,22.86 180 top
C9  113.03,30.48 90 top
C10  71.12,21.59 0 top
C11  71.12,44.45 0 top
C12  71.12,67.31 0 top
C13  109.22,67.31 0 top
C14  146.05,101.6 270 top
C15  146.05,93.98 270 top
C16  158.75,101.6 90 top
C17  158.75,93.98 270 top
C18  109.22,90.17 0 top
C19  82.55,105.41 90 top
C20  55.88,30.48 90 top
C21  182.88,30.48 90 top
C22  119.38,30.48 90 top
D1  181.61,83.82 270 top
E1  175.26,95.25 270 top
E2  160.02,36.83 90 top
E3  MAX232  [DIL16']  152.4,95.25 270 top
E4  110.49,78.74 90 top
E5  110.49,101.6 90 top
E6  102.87,30.48 90 top
E7  87.63,78.74 90 top
E8  72.39,33.02 90 top
E9  72.39,55.88 90 top
E10  72.39,78.74 90 top
E11  33.02,36.83 90 top
IOB  189.23,0 90 top
J1  142.24,72.39 90 top
OSC  72.39,105.41 90 top
OSC1  72.39,101.6 90 top
PGM  158.75,69.85 180 top
PGM1  31.75,69.85 180 top
R1  184.15,96.52 90 top
R3  181.61,96.52 90 top
R4  186.69,95.25 270 top
R6  168.91,81.28 270 top
R10  166.37,81.28 270 top
R15  168.91,95.25 90 top
R21  166.37,95.25 90 top
R23  163.83,96.52 90 top
RX3  93.98,35.56 270 top
RX4  91.44,35.56 270 top
RX5  88.9,35.56 270 top
RX6  86.36,35.56 270 top
RX7  83.82,35.56 270 top
RX8  81.28,35.56 270 top
STPBIT1  29.21,58.42 0 top
SV1  177.8,55.88 270 top
SV2  114.3,55.88 270 top
SV3  50.8,55.88 270 top
TX3  93.98,22.86 270 top
TX4  91.44,22.86 270 top
TX5  88.9,22.86 270 top
TX6  86.36,22.86 270 top
TX7  83.82,22.86 270 top
TX8  81.28,22.86 270 top
TX_RATE1  39.37,58.42 0 top
U$2  0,0 0 top

### Tracks (layer width: path | path; a pad name or v marks a point on that pad's centre or on a via)
!ACCLR  (via drill 0.81)
  Top 0.406: E2.34 160.02,41.91 v144.78,41.91
  Bottom 0.406: v144.78,41.91 144.78,16.51 146.69,14.61 146.69,8.26 IOB.P2
!BMB3  (via drill 0.81)
  Top 0.406: v100.97,15.24 101.6,15.24 102.23,14.61 102.23,8.26 BMB.H1
  Bottom 0.406: 94.61,26.04 95.25,26.67 95.25,36.83 RX3.1 | 94.61,26.04 TX3.1 | 94.61,26.04 97.79,22.86 97.79,21.59 100.97,18.42 v100.97,15.24
!BMB4  (via drill 0.81)
  Top 0.406: v100.33,21.59 97.79,19.05 v95.25,19.05 | v94.61,15.24 93.98,15.24 93.34,14.61 93.34,8.26 BMB.L1
  Bottom 0.406: TX4.1 91.44,26.04 92.71,27.31 92.71,36.83 RX4.1 93.34,40.01 96.52,40.01 96.52,26.04 98.42,24.13 100.33,24.13 v100.33,21.59 | v95.25,19.05 94.61,18.42 v94.61,15.24
!BMB5  (via drill 0.81)
  Top 0.406: TX5.1 88.9,27.94 v78.74,27.94 | v78.74,20.32 80.01,19.05 v82.55,19.05 | v85.09,15.24 84.45,15.24 83.82,14.61 83.82,8.26 BMB.P1
  Bottom 0.406: TX5.1 88.9,26.04 90.17,27.31 90.17,36.83 RX5.1 | v78.74,20.32 v78.74,27.94 | v82.55,19.05 85.09,16.51 v85.09,15.24
!BMB6  (via drill 0.81)
  Top 0.406: v101.6,46.99 v89.53,46.99
  Bottom 0.406: TX6.1 86.36,26.04 87.63,27.31 87.63,36.83 RX6.1 89.53,41.28 v89.53,46.99 | v101.6,46.99 111.76,36.83 111.76,8.26 BMB.D2
!BMB7  (via drill 0.81)
  Top 0.406: v100.33,45.72 v83.82,45.72
  Bottom 0.406: TX7.1 83.82,27.31 85.09,28.58 85.09,36.2 83.82,37.47 RX7.1 v83.82,45.72 | v100.33,45.72 102.87,43.18 102.87,8.26 BMB.H2
!BMB8  (via drill 0.81)
  Top 0.406: TX8.1 82.55,24.13 87,24.13 87.63,23.5 87.63,21.59 89.53,21.59 90.17,20.96 v90.17,19.05
  Bottom 0.406: TX8.1 81.28,31.12 82.55,32.39 82.55,36.83 RX8.1 | v90.17,19.05 90.17,8.26 BMB.M2
!INIT  (via drill 0.81)
  Top 0.406: SV3.3 v33.02,60.96 | SV1.3 171.45,55.88 v161.29,55.88
  ECO1 0.406: SV3.3 50.8,62.23 113.03,62.23 | SV2.3 113.03,62.23 | 113.03,62.23 175.26,62.23 SV1.3
  Bottom 0.406: E11.33 33.02,46.99 v33.02,60.96 | E2.1 160.02,38.1 160.02,43.82 161.29,45.09 E2.33 v161.29,55.88
!IOB0  (via drill 0.81)
  Top 0.406: v170.18,17.78 179.07,17.78 181.61,15.24 181.61,8.26 IOB.B1
  Bottom 0.406: E2.24 170.18,36.83 v170.18,17.78
!IOB1  (via drill 0.81)
  Top 0.406: E2.20 173.35,33.02 v177.16,29.21 | v177.16,15.24 176.53,15.24 175.9,14.61 175.9,8.26 IOB.D1
  Bottom 0.406: v177.16,15.24 v177.16,29.21
!IOB2  (via drill 0.81)
  Top 0.406: E2.19 170.18,26.67 177.8,26.67 179.71,24.77 179.71,21.59 v174.62,21.59 | v173.99,15.24 173.35,15.24 172.72,14.61 172.72,8.26 IOB.E1
  Bottom 0.406: v174.62,21.59 173.99,20.96 v173.99,15.24
!IOB3  (via drill 0.81)
  Top 0.406: v166.37,17.15 166.37,8.26 IOB.H1
  Bottom 0.406: v166.37,17.15 E2.17
!IOB4  (via drill 0.81)
  Top 0.406: v165.1,15.88 164.47,15.24 163.83,15.24 163.19,14.61 163.19,8.26 IOB.J1
  Bottom 0.406: E2.16 165.1,29.21 v165.1,15.88
!IOB5  (via drill 0.81)
  Top 0.406: v160.02,19.05 158.75,17.78 v157.48,17.78 | v154.94,15.24 155.57,15.24 156.21,14.61 156.21,8.26 IOB.L1
  Bottom 0.406: E2.11 160.02,26.67 v160.02,19.05 | v154.94,15.24 v157.48,17.78
!IOB6  (via drill 0.81)
  Top 0.406: E2.12 157.48,29.21 155.57,29.21 154.94,28.58 v154.94,19.69 | v151.76,15.24 152.4,15.24 153.03,14.61 153.03,8.26 IOB.M1
  Bottom 0.406: v154.94,19.69 151.76,16.51 v151.76,15.24
!IOB7  (via drill 0.81)
  Top 0.406: v148.59,15.24 147.96,15.24 147.32,14.61 147.32,8.26 IOB.P1
  Bottom 0.406: E2.8 154.94,29.21 154.94,26.67 148.59,20.32 v148.59,15.24
!IOB8  (via drill 0.81)
  Top 0.406: E2.5 152.4,31.75 150.5,31.75 v142.24,23.5 | v142.24,15.24 141.6,15.24 140.97,14.61 140.97,8.26 IOB.S1
  Bottom 0.406: v142.24,15.24 v142.24,23.5
!IOB9  (via drill 0.81)
  Top 0.406: E2.25 167.64,39.37 v177.8,39.37
  Bottom 0.406: v177.8,39.37 176.53,38.1 176.53,30.48 175.9,29.85 175.9,8.26 IOB.D2
!IOB10  (via drill 0.81)
  Top 0.406: E2.21 167.64,31.75 v172.72,31.75
  Bottom 0.406: v172.72,31.75 172.72,8.26 IOB.E2
!IOB11
  Bottom 0.406: E2.18 167.64,29.21 167.64,15.88 166.37,14.61 166.37,8.26 IOB.H2
!IRQ  (via drill 0.81)
  Top 0.406: E2.29 178.44,45.72 180.34,47.63 180.34,60.96 SV1.4 | v181.61,27.31 181.61,20.32 v157.48,20.32
  ECO2 0.406: SV1.4 177.8,62.23 115.57,62.23 | 115.57,62.23 53.34,62.23 SV3.4 | SV2.4 115.57,62.23
  Bottom 0.406: E11.29 46.35,52.71 46.35,62.23 48.9,64.77 50.8,64.77 50.8,62.23 SV3.4 | SV1.4 181.61,58.42 v181.61,27.31 | v157.48,20.32 153.67,16.51 153.67,8.26 IOB.M2
!RX_SEL
  Top 0.406: E8.8 66.04,43.18 66.04,46.99 74.93,46.99 E9.1
!SKIP  (via drill 0.81)
  Top 0.406: E11.28 45.72,46.99 52.7,46.99 53.34,47.63 53.34,58.42 SV3.6 | v161.29,24.13 v178.44,24.13
  ECO2 0.406: SV3.6 53.34,59.69 115.57,59.69 | 115.57,59.69 177.8,59.69 SV1.6 | SV2.6 115.57,59.69
  Bottom 0.406: E2.28 173.99,48.26 173.99,55.25 175.9,57.15 179.07,57.15 | SV1.6 179.07,57.15 | 179.07,57.15 180.34,57.15 180.34,26.04 v178.44,24.13 | v161.29,24.13 161.29,15.88 160.02,14.61 160.02,8.26 IOB.K2
!TX_SEL
  Bottom 0.406: E9.13 72.39,54.61 72.39,67.95 73.03,68.58 78.74,68.58 78.74,57.79 87,49.53 99.06,49.53 E6.8
-15V  (via drill 0.81)
  Top 0.711: v137.79,96.52 144.15,102.87 158.12,102.87 163.19,97.79 175.26,97.79 E1.12
  Bottom 0.711: R15.1 168.91,87.63 | 168.91,87.63 R6.1 | E1.12 180.34,92.71 180.34,90.81 179.71,90.17 172.72,90.17 172.72,88.27 172.09,87.63 168.91,87.63 | J1.EE 137.79,63.5 v137.79,96.52
BAC0  (via drill 0.81)
  Top 0.406: E11.24 43.18,39.37 v49.53,39.37 | v53.34,15.24 53.98,15.24 54.61,14.61 54.61,8.26 BAC.B1
  Bottom 0.406: v49.53,39.37 53.34,35.56 v53.34,15.24
BAC1  (via drill 0.81)
  Top 0.406: v46.99,15.24 47.62,15.24 48.26,14.61 48.26,8.26 BAC.D1
  Bottom 0.406: E11.20 46.99,33.02 v46.99,15.24
BAC2  (via drill 0.81)
  Top 0.406: E11.19 40.64,31.75 42.55,31.75 v43.81,30.48 | v43.81,15.24 44.45,15.24 45.09,14.61 45.09,8.26 BAC.E1
  Bottom 0.406: v43.81,15.24 v43.81,30.48
BAC3  (via drill 0.81)
  Top 0.406: v39.37,17.15 39.37,8.26 BAC.H1
  Bottom 0.406: v39.37,17.15 E11.17
BAC4  (via drill 0.81)
  Top 0.406: v38.1,15.88 37.47,15.24 36.83,15.24 36.2,14.61 36.2,8.26 BAC.J1
  Bottom 0.406: E11.16 38.1,29.21 v38.1,15.88
BAC5  (via drill 0.81)
  Top 0.406: v31.11,15.24 30.48,15.24 29.84,14.61 29.84,8.26 BAC.L1
  Bottom 0.406: E11.11 31.75,24.77 33.02,23.5 33.02,17.15 v31.11,15.24
BAC6  (via drill 0.81)
  Top 0.406: v27.94,17.78 27.94,15.24 27.3,15.24 26.67,14.61 26.67,8.26 BAC.M1
  Bottom 0.406: E11.12 30.48,31.75 27.94,31.75 v27.94,17.78
BAC7  (via drill 0.81)
  Top 0.406: v21.59,25.4 E11.8 | v21.59,15.24 20.95,15.24 20.32,14.61 20.32,8.26 BAC.P1
  Bottom 0.406: v21.59,15.24 v21.59,25.4
BAC8  (via drill 0.81)
  Top 0.406: E11.5 25.4,31.75 22.23,31.75 v15.24,24.77 | v15.24,15.24 14.61,15.24 13.97,14.61 13.97,8.26 BAC.S1
  Bottom 0.406: v15.24,15.24 v15.24,24.77
BAC9
  Bottom 0.406: E11.25 40.64,36.83 40.64,34.93 41.27,34.29 48.26,34.29 48.26,8.26 BAC.D2
BAC10
  Bottom 0.406: E11.21 40.64,31.75 45.09,31.75 45.09,8.26 BAC.E2
BAC11
  Bottom 0.406: E11.18 40.64,29.21 40.64,15.88 39.37,14.61 39.37,8.26 BAC.H2
BD109
  Top 0.406: E4.8 107.95,85.09 114.94,85.09 116.84,83.19 116.84,59.69 81.28,59.69 BAUD.25
BD150
  Bottom 0.406: E5.8 85.09,109.22 85.09,63.5 BAUD.23
BD300
  Bottom 0.406: E5.9 88.9,106.68 88.9,60.33 88.27,59.69 85.09,59.69 BAUD.21
BD600
  Bottom 0.406: E5.10 107.95,105.41 107.95,107.32 107.31,107.95 87.63,107.95 BAUD.19
BD1200
  Bottom 0.406: E5.11 95.25,90.17 95.25,71.76 90.17,66.68 BAUD.17
BD1745
  Top 0.406: E7.13 85.09,74.93 105.41,74.93 | E4.13 105.41,74.93 | E4.6 115.57,82.55 115.57,74.93 105.41,74.93
BD2400
  Bottom 0.406: E5.6 113.03,105.41 113.03,102.87 E5.13 98.42,88.27 98.42,73.66 92.71,67.95 BAUD.15
BD4800
  Bottom 0.406: E5.5 116.84,101.6 116.84,66.68 114.3,64.14 114.3,57.79 113.67,57.15 96.52,57.15 96.52,59.06 95.25,60.33 BAUD.13
BD9600
  Bottom 0.406: E5.4 107.95,95.25 107.95,89.54 99.69,81.28 99.69,62.87 BAUD.11
BD19200
  Bottom 0.406: E4.1 115.57,72.39 115.57,97.79 E5.3 110.49,95.25 110.49,85.09 106.05,85.09 101.6,80.65 101.6,62.23 BAUD.9
BD38400  (via drill 0.81)
  Top 0.406: E10.5 77.47,82.55 90.17,82.55 E7.5 97.79,87.63 102.87,87.63 | E5.1 114.3,87.63 102.87,87.63 | 102.87,87.63 v102.87,80.01
  Bottom 0.406: v102.87,80.01 BAUD.7
BD57600  (via drill 0.81)
  Top 0.406: E10.4 77.47,80.01 90.17,80.01 E7.4 91.44,78.11 | 91.44,78.11 E7.3 | 91.44,78.11 v104.14,78.11
  Bottom 0.406: BAUD.5 104.14,62.23 v104.14,78.11
BD115200
  Bottom 0.406: E10.3 81.28,71.12 81.28,57.79 81.92,57.15 93.98,57.15 93.98,61.6 94.61,62.23 96.52,62.23 96.52,60.33 97.16,59.69 107.95,59.69 BAUD.3
BD230400
  Top 0.406: E10.1 85.09,62.23 109.22,62.23 BAUD.1
  Bottom 0.406: OSC.5 74.93,102.87 74.93,72.39 E10.1
BIOP1  (via drill 0.81)
  Top 0.406: SV3.5 50.8,59.69 53.34,59.69 57.15,55.88 57.15,26.67 v35.56,26.67
  ECO1 0.406: SV1.5 175.26,59.69 113.03,59.69 | 113.03,59.69 50.8,59.69 SV3.5 | SV2.5 113.03,59.69
  Bottom 0.406: E11.14 33.02,29.21 33.02,26.67 34.29,25.4 | 34.29,25.4 34.29,15.88 33.02,14.61 33.02,8.26 BAC.K2 | 34.29,25.4 v35.56,26.67 | E2.14 161.29,38.74 165.1,42.55 165.1,48.9 167,50.8 167,69.22 167.64,69.85 175.26,69.85 175.26,59.69 SV1.5
BIOP2  (via drill 0.81)
  Top 0.406: v54.61,38.1 45.72,29.21 30.48,29.21 E11.9 | E2.9 158.75,25.4 v173.99,25.4
  ECO1 0.406: SV3.7 50.8,57.15 113.03,57.15 | 113.03,57.15 175.26,57.15 SV1.7 | SV2.7 113.03,57.15
  Bottom 0.406: E11.9 29.21,17.15 26.67,14.61 26.67,8.26 BAC.M2 | SV3.7 50.8,54.61 54.61,54.61 v54.61,38.1 | v173.99,25.4 174.62,26.04 174.62,36.83 175.26,37.47 175.26,54.61 SV1.7
BIOP4  (via drill 0.81)
  Top 0.406: SV3.9 48.9,52.71 v21.59,52.71 | v148.59,49.53 152.4,53.34 SV1.9
  ECO1 0.406: SV1.9 175.26,54.61 152.4,54.61 151.13,55.88 148.59,55.88 147.32,54.61 113.03,54.61 | 113.03,54.61 50.8,54.61 SV3.9 | SV2.9 113.03,54.61
  Bottom 0.406: 21.59,27.94 20.32,26.67 20.32,8.26 BAC.P2 | 21.59,27.94 E11.6 | 21.59,27.94 v21.59,52.71 | E2.6 148.59,33.02 v148.59,49.53
BMB3  (via drill 0.81)
  Top 0.406: v97.79,15.24 98.42,15.24 99.06,14.61 99.06,8.26 BMB.J1
  Bottom 0.406: TX3.3 92.71,21.59 92.71,24.13 | 92.71,24.13 92.71,26.04 93.98,27.31 RX3.3 | 92.71,24.13 95.25,24.13 95.25,23.5 96.52,22.23 96.52,21.59 97.79,20.32 v97.79,15.24
BMB4  (via drill 0.81)
  Top 0.406: v91.44,15.24 90.81,15.24 90.17,14.61 90.17,8.26 BMB.M1
  Bottom 0.406: RX4.3 91.44,27.31 90.17,26.04 90.17,21.59 TX4.3 v91.44,15.24
BMB5
  Top 0.406: TX5.3 87.63,19.05 84.45,19.05 83.19,17.78 80.01,17.78 77.47,15.24 77.47,8.26 BMB.S1
  Bottom 0.406: TX5.3 87.63,21.59 87.63,26.04 88.9,27.31 RX5.3
BMB6  (via drill 0.81)
  Top 0.406: RX6.3 87.63,31.75 v107.95,31.75
  Bottom 0.406: TX6.3 86.36,20.96 85.09,22.23 85.09,27.31 86.36,28.58 RX6.3 | v107.95,31.75 108.58,31.12 108.58,8.26 BMB.E2
BMB7  (via drill 0.81)
  Top 0.406: RX7.3 87.63,29.21 88.9,29.21 90.17,27.94 90.17,22.23 90.81,21.59 v95.25,21.59
  Bottom 0.406: TX7.3 82.55,21.59 82.55,27.31 83.82,28.58 RX7.3 | v95.25,21.59 96.52,20.32 96.52,8.26 BMB.K2
BMB8
  Bottom 0.406: BMB.P2 83.19,8.26 83.19,14.61 81.28,16.51 TX8.3 80.01,21.59 80.01,31.75 RX8.3
DIV3
  Top 0.711: E10.2 74.93,74.93 74.93,85.09 90.17,85.09 E7.6
DIV11
  Top 0.406: E7.12 82.55,74.93 82.55,72.39 113.03,72.39 E4.2
DSRDTR
  Top 0.406: E3.13 154.94,95.25 137.79,95.25 133.99,91.44 133.99,67.31 142.24,67.31 J1.DD
DSRTTL
  Bottom 0.406: E2.40 151.13,84.46 154.94,88.27 154.94,92.71 E3.12
GND  (via drill 0.81)
  Top 0.711: 142.88,16.51 137.79,16.51 137.79,8.26 IOB.T1 | 142.88,16.51 143.51,15.88 143.51,8.26 IOB.R1 | 149.86,16.51 149.86,8.26 IOB.N1 | 142.88,16.51 149.86,16.51 | 159.38,16.51 159.38,8.26 IOB.K1 | 149.86,16.51 156.21,16.51 | 156.21,16.51 159.38,16.51 | 168.91,18.42 168.91,16.51 | 168.91,16.51 168.91,8.26 IOB.F1 | 168.91,18.42 161.29,18.42 159.38,16.51 | 168.91,16.51 178.44,16.51 178.44,8.26 IOB.C1 | 168.91,18.42 169.54,19.05 179.71,19.05 180.34,18.42 184.78,18.42 184.78,8.26 IOB.A1 | C4.2 157.48,21.59 156.84,21.59 156.21,20.96 156.21,16.51 | E1.9 176.53,88.9 E1.7 | E1.13 180.34,95.25 180.34,92.71 172.72,92.71 E1.6 166.37,96.52 C17.1 157.48,97.79 144.78,97.79 J1.B J1.A | SV1.14 SV1.13 175.26,46.99 165.74,46.99 165.1,46.36 165.1,44.45 167.64,44.45 | 167.64,44.45 E2.30 | 167.64,44.45 172.72,44.45 C2.2 180.34,43.18 C21.- | SV1.2 SV1.1 168.91,63.5 PGM.2 160.66,65.41 156.84,65.41 PGM.10 | E2.42 C1.2 | C3.2 151.13,48.26 J1.VV J1.UU | 15.88,16.51 10.79,16.51 10.79,8.26 BAC.T1 | 15.88,16.51 16.51,15.88 16.51,8.26 BAC.R1 | v22.86,16.51 22.86,8.26 BAC.N1 | 15.88,16.51 v16.51,16.51 v22.86,16.51 | BAC.F1 41.91,8.26 v41.91,15.88 41.91,16.51 | SV3.2 SV3.1 44.45,68.58 PGM1.2 34.92,66.68 28.57,66.68 PGM1.10 | C5.2 E11.42 25.4,41.91 27.3,41.91 27.94,42.55 27.94,49.53 | SV3.14 SV3.13 | 27.94,49.53 30.48,46.99 37.47,46.99 38.1,46.36 38.1,43.18 E11.30 | 27.94,49.53 C7.2 | C20.- 53.34,43.18 C6.2 | E11.10 33.02,34.29 40.64,34.29 E11.22 | 32.38,19.05 32.38,22.86 C8.2 | 32.38,19.05 32.38,18.42 | 32.38,18.42 32.38,15.88 | 32.38,15.88 32.38,8.26 BAC.K1 | 32.38,15.88 v35.56,15.88 | 41.91,16.51 41.91,18.42 32.38,18.42 | 51.44,16.51 51.44,8.26 BAC.C1
  Top 0.711: 41.91,16.51 51.44,16.51 | 51.44,16.51 57.78,16.51 57.78,8.26 BAC.A1 | v22.86,16.51 25.4,19.05 32.38,19.05 | C11.2 v76.2,44.45 | C10.2 73.66,8.26 BMB.T1 | 85.72,16.51 80.64,16.51 80.64,8.26 BMB.R2 | 86.36,15.88 85.72,16.51 | 86.36,15.88 86.36,8.26 BMB.N2 | 86.36,15.88 v87,15.88 | 85.72,16.51 v92.71,16.51 95.89,16.51 | 95.89,16.51 95.89,8.26 BMB.K1 | 95.89,16.51 v99.06,16.51 105.41,16.51 105.41,15.24 | 105.41,15.24 105.41,8.26 BMB.F2 | 114.94,15.24 114.94,8.26 BMB.C2 | 105.41,15.24 114.94,15.24 | 121.28,15.24 121.28,8.26 BMB.A1 | 114.94,15.24 121.28,15.24 | SV2.14 SV2.13 113.03,40.64 | E6.7 109.22,40.64 113.03,40.64 | C22.- 113.03,40.64 | 113.03,40.64 C9.2 121.28,33.02 121.28,15.24 | SV2.1 SV2.2 | 76.2,87.63 E10.7 | 76.2,87.63 90.17,87.63 E7.7 93.98,88.9 110.49,88.9 C18.2 | OSC1.7 81.28,109.22 C19.2 113.03,107.95 | E5.12 109.22,96.52 113.03,96.52 | E5.2 113.03,96.52 | 113.03,107.95 E5.7 | 113.03,96.52 113.03,107.95 | C12.2 71.12,69.85 67.94,69.85 67.31,70.49 67.31,87.63 76.2,87.63
  ECO1 0.711: SV3.2 53.34,64.77 111.76,64.77 SV2.1 SV2.2 116.84,64.77 175.26,64.77 SV1.1
  Bottom 0.711: 157.48,24.13 C4.2 158.75,17.15 156.84,15.24 156.84,8.26 IOB.L2 | 157.48,29.21 157.48,24.13 | E2.10 157.48,29.21 | 157.48,24.13 150.5,17.15 150.5,8.26 IOB.N1 | 161.93,29.21 162.56,28.58 162.56,8.26 IOB.J2 | 157.48,29.21 161.93,29.21 | E1.6 E1.7 | J1.A J1.C | C17.1 157.48,97.79 157.48,100.33 E3.15 | 167.64,36.83 E2.22 | 167.64,36.83 167.64,38.74 168.28,39.37 171.45,39.37 | 171.45,39.37 173.99,39.37 C2.2 | C3.2 PGM.10 | 146.05,45.09 146.05,45.72 J1.VV | 146.05,45.09 C1.2 | 146.05,45.09 143.51,42.55 | 143.51,42.55 134.62,33.66 134.62,8.26 IOB.U2 | 143.51,42.55 143.51,8.26 IOB.R1 | 171.45,39.37 171.45,17.15 169.54,15.24 169.54,8.26 IOB.F1 | IOB.C1 179.07,8.26 179.07,22.86 182.88,26.67 C21.- 182.88,59.69 SV1.2 E1.9 | 161.93,29.21 162.56,29.85 162.56,33.66 165.74,36.83 167.64,36.83 | BAC.U2 7.62,8.26 7.62,19.05 14.61,26.04 16.51,26.04 v16.51,16.51 16.51,8.26 BAC.R1 | v22.86,16.51 22.86,8.26 BAC.N1 | v41.91,15.88 41.91,8.26 BAC.F1 | E11.10 30.48,29.21 30.48,24.13 C8.2 31.75,17.78 29.84,15.88 29.84,8.26 BAC.L2 | 46.99,40.64 E11.22 | 46.99,41.91 C6.2 46.99,45.72 47.62,46.36 | 46.99,41.91 46.99,40.64 | E11.30 40.64,41.91 46.99,41.91 | 47.62,46.36 SV3.13 | SV3.1 47.62,61.6 47.62,46.36 | v35.56,15.88 35.56,8.26 BAC.J2 | 46.99,40.64 46.99,40.01 51.44,35.56 51.44,8.26 BAC.C1 | v76.2,44.45 E8.7 | 73.66,66.04 E9.7 | C12.2 73.66,66.04 | 73.66,66.04 C11.2 C10.2 | C10.2 71.12,19.05 71.12,8.26 BMB.U2 | C10.2 80.01,15.24 80.01,8.26 BMB.R2 | v87,15.88 87,8.26 BMB.N2 | v92.71,16.51 92.71,8.26 BMB.L2 | v99.06,16.51 99.06,8.26 BMB.J2 | SV2.1 113.03,66.04 C13.2 111.76,71.12 E4.12 113.03,82.55 113.03,87.63 | 113.03,87.63 111.76,88.9 C18.2 111.76,93.98 E5.2
  Bottom 0.711: 113.03,87.63 E4.7 | SV2.14 117.47,50.17 117.47,61.6 SV2.2 | E6.7 105.41,36.83 105.41,8.26 BMB.F2 | C9.2 114.94,31.12 114.94,8.26 BMB.C2
  pour Top: 0,19.05 189.23,19.05 189.23,114.3 0,114.3
  pour Bottom: 0,19.05 189.23,19.05 189.23,114.3 0,114.3
INITIALIZE  (via drill 0.81)
  Top 0.406: v19.68,33.02 E11.4
  Bottom 0.406: E11.4 25.4,34.29 25.4,36.83 E11.1 | v19.68,33.02 4.45,17.78 4.45,8.26 BAC.V2
N$5
  Top 0.406: E1.2 R15.2
N$7
  Top 0.406: R23.2 R21.2 167.64,102.87 177.8,102.87 E1.16
N$12  (via drill 0.81)
  Top 0.406: v93.98,76.2 94.61,76.84 105.41,76.84 106.05,77.47 113.03,77.47 E4.3
  Bottom 0.406: v93.98,76.2 E7.2
N$15
  Bottom 0.406: R10.1 165.1,87.63 165.1,89.54 169.54,93.98 E1.5
N$16
  Top 0.406: E3.6 149.86,92.71 157.48,92.71 C17.2
N$17
  Top 0.406: E3.1 C14.1
N$25  (via drill 0.81)
  Top 0.406: E7.1 92.71,69.85 v113.03,69.85
  Bottom 0.406: v113.03,69.85 113.03,77.47 E4.4
N$827
  Top 0.406: E3.3 C14.2
N$914
  Top 0.406: E3.5 C15.2
N$915
  Top 0.406: E3.4 C15.1
N$916
  Top 0.406: C16.1 157.48,100.33 149.86,100.33 E3.2
R_RUN
  Bottom 0.406: E3.11 165.1,100.33 170.18,100.33 170.18,102.87 E1.1
READER_RUN+  (via drill 0.81)
  Top 0.711: J1.PP 139.06,51.44 139.06,46.36 152.4,46.36 155.57,49.53 v163.83,49.53
  Bottom 0.711: R23.1 163.83,83.19 167.64,79.38 | 167.64,79.38 168.91,78.11 R6.2 165.74,73.03 165.74,51.44 v163.83,49.53 | R21.1 167.64,87.63 167.64,79.38
RTS  (via drill 0.81)
  Top 0.406: v152.4,99.06 E3.14
  Bottom 0.406: v152.4,99.06 149.86,96.52 149.86,82.55 J1.V
RX3  (via drill 0.81)
  Top 0.406: v80.01,40.64 90.81,40.64 92.71,38.74 92.71,35.56 RX3.2
  Bottom 0.406: E8.3 80.01,34.29 v80.01,40.64
RX4
  Top 0.406: E8.4 79.38,33.02 80.64,34.29 90.17,34.29 RX4.2
RX5  (via drill 0.81)
  Top 0.406: v78.74,38.1 80.01,39.37 87,39.37 87.63,38.74 87.63,35.56 RX5.2
  Bottom 0.406: v78.74,38.1 E8.5
RX6
  Bottom 0.406: E8.6 78.74,40.64 78.74,42.55 83.19,46.99 85.09,46.99 85.09,37.47 86.36,36.2 RX6.2
RX7
  Top 0.406: E8.11 71.12,33.02 74.93,36.83 82.55,36.83 RX7.2
RX8
  Top 0.406: E8.12 71.75,30.48 75.56,34.29 79.38,34.29 80.64,35.56 RX8.2
RX20MA_DATA
  Top 0.406: J1.H 142.24,90.17 177.8,90.17 E1.10
  Bottom 0.406: E1.10 180.97,87 184.15,87 R1.1
RX_20MA+  (via drill 0.81)
  Top 0.711: D1.C R3.1 | J1.K 137.16,90.17 v136.53,90.17 | v136.53,99.06 144.15,106.68 v178.44,106.68
  Bottom 0.711: v136.53,99.06 v136.53,90.17 | v178.44,106.68 180.34,104.78 180.34,94.62 181.61,93.35 R3.1
RX_20MA-  (via drill 0.81)
  Top 0.711: D1.A 179.07,78.74 E1.8 170.18,87.63 154.94,87.63 v153.67,88.9
  Bottom 0.711: J1.S 139.06,80.65 139.06,96.52 142.88,100.33 153.67,100.33 v153.67,88.9
RX_DATA  (via drill 0.81)
  Top 0.406: v168.28,68.58 154.31,82.55 140.34,82.55 135.25,87.63 135.25,91.44 J1.E
  Bottom 0.406: E2.27 167.64,41.91 167.64,48.9 168.28,49.53 v168.28,68.58
RX_RATE  (via drill 0.81)
  Top 0.406: E11.2 22.86,34.29 18.41,34.29 16.51,36.2 16.51,59.69 40.64,59.69 TX_RATE1.3 43.18,57.15 50.8,57.15 SV3.8 | v149.86,39.37 152.4,39.37 E2.43 | SV1.8 177.8,54.61 v149.86,54.61
  ECO2 0.406: SV1.8 177.8,57.15 115.57,57.15 | 115.57,57.15 53.34,57.15 SV3.8 | SV2.8 115.57,57.15
  Bottom 0.406: E2.2 149.86,36.83 v149.86,39.37 v149.86,54.61
RX_SEL  (via drill 0.81)
  Top 0.406: E9.2 77.47,52.07 114.3,52.07 SV2.12 | E11.26 46.99,45.72 v48.9,45.72 | E2.26 170.18,41.91 v176.53,41.91
  ECO2 0.406: SV1.12 177.8,52.07 162.56,52.07 161.29,53.34 158.75,53.34 157.48,52.07 115.57,52.07 | 115.57,52.07 53.34,52.07 SV3.12 | SV2.12 115.57,52.07
  Bottom 0.406: v48.9,45.72 50.8,47.63 50.8,49.53 SV3.12 | v176.53,41.91 177.8,43.18 177.8,49.53 SV1.12
RXD232
  Top 0.406: E3.8 146.05,88.9 J1.J
RXDTTL
  Top 0.406: E3.9 154.94,85.09 142.24,85.09 J1.M
STOP1
  Bottom 0.406: E11.37 30.48,46.99 30.48,57.15 STPBIT1.3
STOP2
  Bottom 0.406: E11.39 25.4,46.99 25.4,57.15 STPBIT1.1
STP_MARK
  Top 0.406: E11.44 22.86,39.37 18.41,39.37 17.78,40.01 17.78,57.15 27.94,57.15 STPBIT1.2
TCKE2
  Bottom 0.406: E2.32 162.56,44.45 162.56,69.85 PGM.1
TCKE11
  Bottom 0.406: E11.32 35.56,44.45 35.56,69.85 PGM1.1
TDIE2
  Bottom 0.406: E2.7 152.4,29.21 152.4,69.85 PGM.9
TDIE11
  Bottom 0.406: E11.7 25.4,29.21 25.4,31.12 24.77,31.75 22.86,31.75 22.86,67.31 PGM1.9
TDOE2  (via drill 0.81)
  Top 0.406: v157.48,72.39 160.02,72.39 PGM.3
  Bottom 0.406: E2.38 157.48,44.45 v157.48,72.39
TDOE11
  Bottom 0.406: E11.38 27.94,44.45 27.94,62.87 33.02,67.95 33.02,69.85 PGM1.3
TMSE2
  Top 0.406: E2.13 160.02,29.21 160.02,34.29 145.41,34.29 137.79,41.91 137.79,64.77 147.96,64.77 153.03,69.85 157.48,69.85 PGM.5
TMSE11
  Top 0.406: E11.13 29.84,23.5 14.61,23.5 13.97,24.13 13.97,69.85 30.48,69.85 PGM1.5
TX3
  Top 0.406: E6.3 102.87,24.13 95.89,24.13 94.61,22.86 TX3.2
TX4
  Top 0.406: E6.4 102.87,26.67 97.16,26.67 94.61,24.13 92.71,24.13 TX4.2
TX5
  Top 0.406: E6.5 97.79,41.91 74.3,41.91 69.22,36.83 67.94,36.83 66.04,34.93 66.04,26.67 87,26.67 87.63,26.04 87.63,24.77 88.9,23.5 TX5.2
TX6
  Top 0.406: E6.6 105.41,35.56 97.79,43.18 73.03,43.18 69.22,39.37 67.94,39.37 64.77,36.2 64.77,22.86 74.93,22.86 76.2,21.59 85.09,21.59 TX6.2
TX7  (via drill 0.81)
  Top 0.406: v101.6,20.32 99.06,17.78 v87,17.78
  Bottom 0.406: E6.11 101.6,27.94 v101.6,20.32 | v87,17.78 85.09,19.69 85.09,20.96 83.82,22.23 TX7.2
TX8  (via drill 0.81)
  Top 0.406: v74.93,24.13 76.2,22.86 TX8.2
  Bottom 0.406: E6.12 97.79,29.21 97.79,40.64 90.17,48.26 77.47,48.26 77.47,47.63 74.93,45.09 v74.93,24.13
TX_20MA+  (via drill 0.81)
  Top 0.711: R4.2 186.69,99.7 187.96,100.97 187.96,102.24 184.78,105.41 144.78,105.41 132.72,93.35 132.72,66.04 v139.06,66.04
  Bottom 0.711: v139.06,66.04 140.97,67.95 J1.AA
TX_20MA-
  Bottom 0.711: E1.11 172.72,97.79 172.72,104.78 172.09,105.41 135.25,105.41 135.25,64.14 J1.KK
TX_RATEI
  Bottom 0.406: E11.43 38.1,40.64 38.1,57.15 TX_RATE1.2
TX_RATEO
  Top 0.406: E11.41 20.32,49.53 20.32,55.88 34.29,55.88 TX_RATE1.1
TX_SEL  (via drill 0.81)
  Top 0.406: v36.83,48.26 39.37,50.8 SV3.11 | E9.12 72.39,49.53 111.76,49.53 SV2.11 | E2.31 163.83,48.26 173.99,48.26 SV1.11
  ECO1 0.406: SV3.11 50.8,52.07 113.03,52.07 | 113.03,52.07 157.48,52.07 158.75,53.34 161.29,53.34 162.56,52.07 175.26,52.07 SV1.11 | SV2.11 113.03,52.07
  Bottom 0.406: v36.83,48.26 E11.31
TXD232
  Bottom 0.406: E3.7 144.78,88.9 144.78,90.17 J1.F
TXDTTL  (via drill 0.81)
  Top 0.406: SV1.10 177.8,52.07 v160.02,52.07 | E11.36 33.02,41.91 40.01,41.91 40.64,42.55 40.64,49.53 50.16,49.53 50.8,50.17 50.8,53.34 SV3.10
  ECO2 0.406: SV3.10 53.34,54.61 115.57,54.61 | 115.57,54.61 147.32,54.61 148.59,55.88 151.13,55.88 152.4,54.61 177.8,54.61 SV1.10 | SV2.10 115.57,54.61
  Bottom 0.406: E2.36 158.75,43.82 160.02,45.09 v160.02,52.07 160.02,71.76 164.47,76.2 | R10.2 164.47,76.2 | E3.10 164.47,80.65 164.47,76.2
VCC  (via drill 0.81)
  Top 0.711: E6.14 E6.1 E6.2 110.49,25.4 112.39,27.31 | 112.39,27.31 C9.1 109.22,31.75 109.22,36.83 106.05,36.83 98.42,44.45 78.11,44.45 76.83,45.72 69.85,45.72 C11.1 | 112.39,27.31 C22.+ | OSC.8 68.58,100.33 | 68.58,100.33 OSC1.14 | 68.58,100.33 80.01,100.33 C19.1 97.79,102.87 E5.14 | E8.14 E8.1 | C13.1 87.63,67.31 E7.14 81.92,71.12 80.64,72.39 69.85,72.39 E10.14 | v34.29,51.44 33.66,50.8 C7.1 | C5.1 20.32,36.83 25.4,36.83 E11.3 30.48,35.56 | 30.48,35.56 E11.23 40.64,36.83 45.72,36.83 C6.1 | E11.35 30.48,44.45 30.48,35.56 | C20.+ 53.34,22.86 C8.1 | E3.16 C16.2 162.56,100.33 177.8,100.33 E1.15 R3.2 R1.2 185.42,101.6 | 185.42,101.6 R4.1 | PGM.4 159.38,66.68 v158.75,66.68 | C1.1 148.59,38.1 E2.44 E2.3 162.56,35.56 | 162.56,35.56 E2.23 167.64,36.83 172.72,36.83 C2.1 182.88,38.1 | E2.15 162.56,29.21 162.56,35.56 | E2.35 160.02,44.45 161.93,44.45 162.56,43.82 162.56,35.56 | 185.42,101.6 185.42,38.1 182.88,38.1 | 182.88,38.1 C21.+
  ECO1 0.711: C10.1 57.15,21.59 C20.+ | C1.1 130.81,20.32 C22.+
  Bottom 0.711: C22.+ 121.28,18.42 121.28,8.26 BMB.A2 | E5.14 C18.1 | E8.2 E8.1 | C10.1 E8.14 67.31,26.67 67.31,43.18 C11.1 E9.14 67.31,49.53 67.31,66.04 | E10.14 C12.1 67.31,66.04 | C13.1 E4.14 | OSC1.14 67.31,92.71 67.31,66.04 | C20.+ 57.78,18.42 57.78,8.26 BAC.A2 | C7.1 E11.35 | v34.29,51.44 PGM1.4 | C8.1 E11.15 35.56,29.21 35.56,31.75 E11.23 | C21.+ 184.78,18.42 184.78,8.26 IOB.A2 | E2.35 C3.1 v158.75,66.68 | E2.15 C4.1
X8_RATE
  Top 0.406: BAUD.26 BAUD.24 BAUD.22 BAUD.20 BAUD.18 BAUD.16 BAUD.14 BAUD.12 BAUD.10 BAUD.8 BAUD.6 BAUD.4 BAUD.2

### Text on the board
Top: IOB | BAC | BMB
Bottom: BAC | BMB | IOB
tPlace: 110 | 150 | 300 | 600 | 1200 | 2400 | 4800 | 9600 | 19200 | 38400 | 57600 | 115200 | 230400 | 0 | 1 | 0 | 1